# Altium project TDII_PCB.PrjPcb
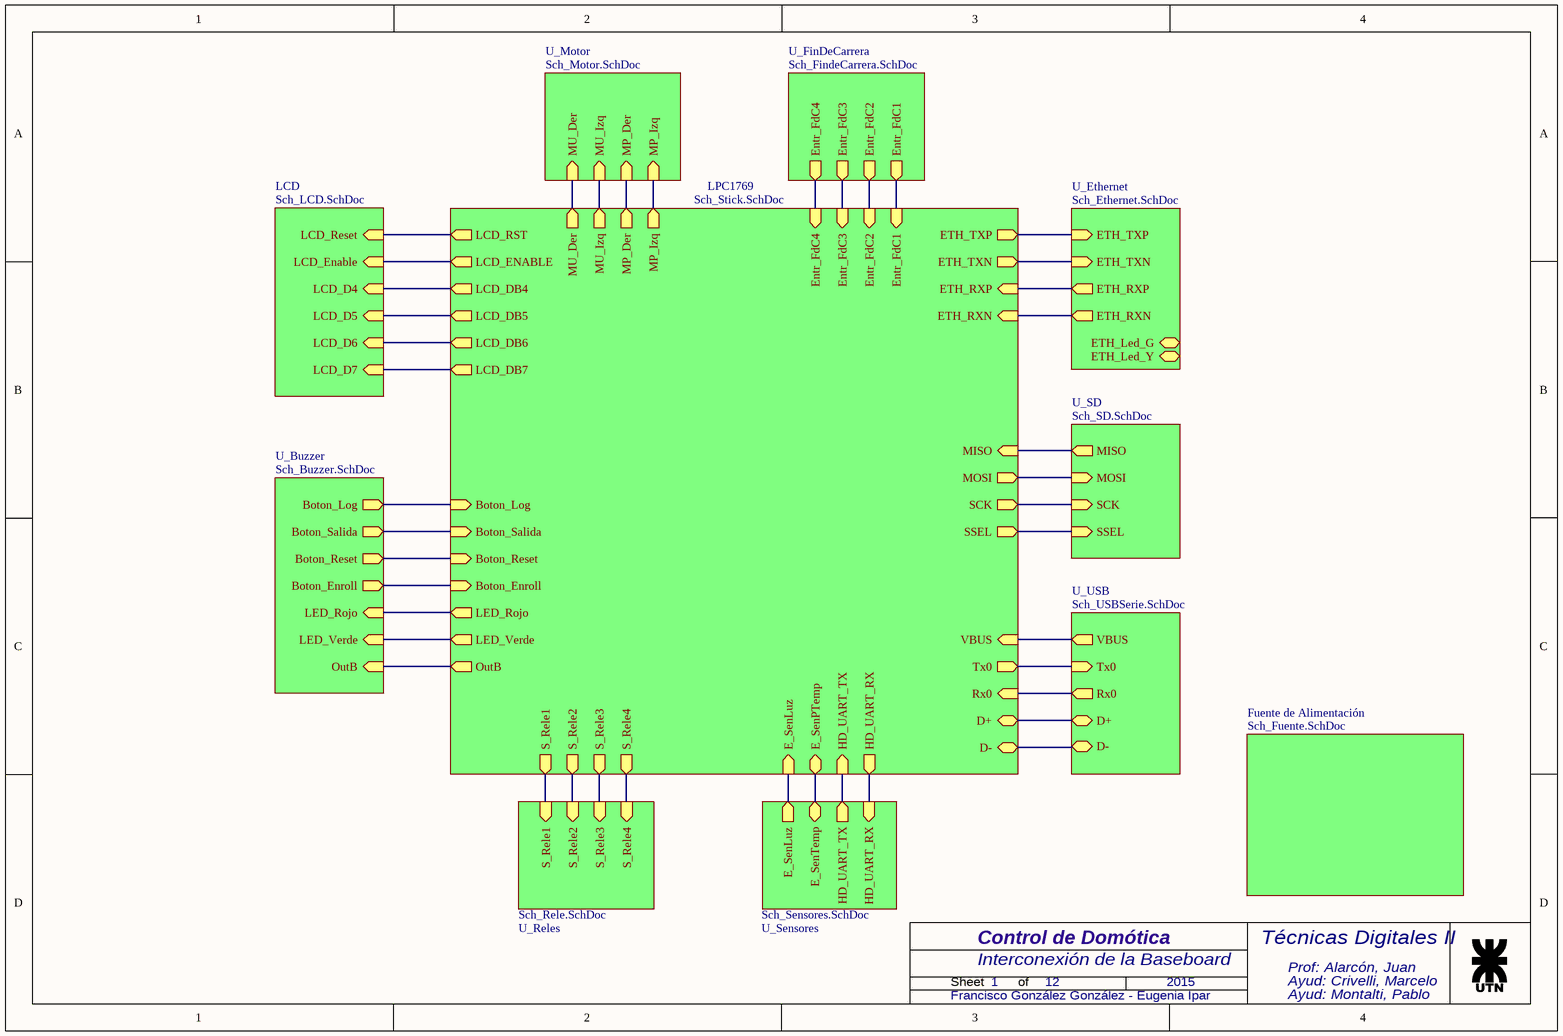
[diagram p0: Sch_BaseBoard.SchDoc]
12 sheets, 134 parts. Net scope: hierarchical (ports join the sheet entries above them; power ports are global).
Board files: PCB_Completo.PcbDoc, PCB_Negativo.PcbDoc
Sheets:
  Sch_BaseBoard.SchDoc
    LPC1769 = Sch_Stick.SchDoc
    U_Ethernet = Sch_Ethernet.SchDoc
    U_Buzzer = Sch_Buzzer.SchDoc
    U_FinDeCarrera = Sch_FindeCarrera.SchDoc
    U_Reles = Sch_Rele.SchDoc
    U_SD = Sch_SD.SchDoc
    U_Sensores = Sch_Sensores.SchDoc
    U_USB = Sch_USBSerie.SchDoc
    U_Motor = Sch_Motor.SchDoc
    LCD = Sch_LCD.SchDoc
    Fuente de Alimentación = Sch_Fuente.SchDoc

## Sheet Sch_BaseBoard.SchDoc: Control de Domótica
size A4; Author: Francisco González González - Eugenia Ipar; CompanyName: Interconexión de la Baseboard; Organization: Altium Limited; Address1: L3, 12a Rodborough Rd; Address2: Frenchs Forest; Address3: NSW; Address4: Australia 2086; DocumentNumber: 1; SheetNumber: 1; SheetTotal: 12; Materia: Técnicas Digitales II; Year: 2015; Placa: Base Board; Prof1: Prof: Alarcón, Juan; Prof2: Ayud: Crivelli, Marcelo; Prof3: Ayud: Montalti, Pablo

### Sub-sheets
Fuente de Alimentación = Sch_Fuente.SchDoc: no entries
LCD = Sch_LCD.SchDoc: LCD_Reset (in), LCD_Enable (in), LCD_D4 (in), LCD_D5 (in), LCD_D6 (in), LCD_D7 (in)
LPC1769 = Sch_Stick.SchDoc: Entr_FdC1 (in), Entr_FdC2 (in), Entr_FdC3 (in), OutB (out), E_SenPTemp (bidir), HD_UART_TX (in), MISO (in), MOSI (out), SCK (out), SSEL (out), Tx0 (out), Rx0 (in), ETH_TXP (out), ETH_TXN (out), ETH_RXP (in), ETH_RXN (in), MP_Izq (out), MP_Der (out), MU_Izq (out), MU_Der (out), D+ (bidir), Entr_FdC4 (in), LCD_RST (out), LCD_ENABLE (out), LCD_DB4 (out), LCD_DB5 (out), LCD_DB6 (out), LCD_DB7 (out), LED_Verde (out), LED_Rojo (out), Boton_Enroll (in), Boton_Reset (in), Boton_Salida (in), S_Rele1 (out), S_Rele2 (out), S_Rele3 (out), S_Rele4 (out), D- (bidir), HD_UART_RX (out), E_SenLuz (in), VBUS (in), Boton_Log (in)
U_Buzzer = Sch_Buzzer.SchDoc: OutB (in), LED_Rojo (in), Boton_Enroll (out), Boton_Reset (out), Boton_Salida (out), LED_Verde (in), Boton_Log (out)
U_Ethernet = Sch_Ethernet.SchDoc: ETH_TXP (in), ETH_TXN (in), ETH_RXP (out), ETH_RXN (out), ETH_Led_G, ETH_Led_Y
U_FinDeCarrera = Sch_FindeCarrera.SchDoc: Entr_FdC1 (out), Entr_FdC2 (out), Entr_FdC3 (out), Entr_FdC4 (out)
U_Motor = Sch_Motor.SchDoc: MP_Izq (in), MP_Der (in), MU_Izq (in), MU_Der (in)
U_Reles = Sch_Rele.SchDoc: S_Rele1 (in), S_Rele2 (in), S_Rele3 (in), S_Rele4 (in)
U_SD = Sch_SD.SchDoc: MISO (out), MOSI (in), SSEL (in), SCK (in)
U_Sensores = Sch_Sensores.SchDoc: E_SenLuz (out), E_SenTemp (bidir), HD_UART_TX (out), HD_UART_RX (in)
U_USB = Sch_USBSerie.SchDoc: Tx0 (in), Rx0 (out), D+ (bidir), D- (bidir), VBUS (out)

### Nets
Boton_Log: sheet LPC1769/Boton_Log, sheet U_Buzzer/Boton_Log
Botón_Enroll: sheet LPC1769/Boton_Enroll, sheet U_Buzzer/Boton_Enroll
Botón_Reset: sheet LPC1769/Boton_Reset, sheet U_Buzzer/Boton_Reset
Botón_Salida: sheet LPC1769/Boton_Salida, sheet U_Buzzer/Boton_Salida
ETH_RXN: sheet LPC1769/ETH_RXN, sheet U_Ethernet/ETH_RXN
ETH_RXP: sheet LPC1769/ETH_RXP, sheet U_Ethernet/ETH_RXP
ETH_TXN: sheet LPC1769/ETH_TXP, sheet U_Ethernet/ETH_TXP
ETH_TXP: sheet LPC1769/ETH_TXN, sheet U_Ethernet/ETH_TXN
FdC1: sheet LPC1769/Entr_FdC1, sheet U_FinDeCarrera/Entr_FdC1
FdC2: sheet LPC1769/Entr_FdC2, sheet U_FinDeCarrera/Entr_FdC2
FdC3: sheet LPC1769/Entr_FdC3, sheet U_FinDeCarrera/Entr_FdC3
FdC4: sheet LPC1769/Entr_FdC4, sheet U_FinDeCarrera/Entr_FdC4
LCD_DB4: sheet LPC1769/LCD_DB4, sheet LCD/LCD_D4
LCD_DB5: sheet LPC1769/LCD_DB5, sheet LCD/LCD_D5
LCD_DB6: sheet LPC1769/LCD_DB6, sheet LCD/LCD_D6
LCD_DB7: sheet LPC1769/LCD_DB7, sheet LCD/LCD_D7
LCD_ENABLE: sheet LPC1769/LCD_ENABLE, sheet LCD/LCD_Enable
LCD_RST: sheet LPC1769/LCD_RST, sheet LCD/LCD_Reset
LED_Rojo: sheet LPC1769/LED_Rojo, sheet U_Buzzer/LED_Rojo
LED_Verde: sheet LPC1769/LED_Verde, sheet U_Buzzer/LED_Verde
MISO: sheet LPC1769/MISO, sheet U_SD/MISO
MOSI: sheet LPC1769/MOSI, sheet U_SD/MOSI
OBuzzer: sheet LPC1769/OutB, sheet U_Buzzer/OutB
Persi_Der: sheet LPC1769/MP_Der, sheet U_Motor/MP_Der
Persi_Izq: sheet LPC1769/MP_Izq, sheet U_Motor/MP_Izq
Puerta_Der: sheet LPC1769/MU_Der, sheet U_Motor/MU_Der
Puerta_Izq: sheet LPC1769/MU_Izq, sheet U_Motor/MU_Izq
Rele1: sheet LPC1769/S_Rele3, sheet U_Reles/S_Rele3
Rele2: sheet LPC1769/S_Rele4, sheet U_Reles/S_Rele4
Rele3: sheet LPC1769/S_Rele2, sheet U_Reles/S_Rele2
Rele4: sheet LPC1769/S_Rele1, sheet U_Reles/S_Rele1
Rx0: sheet LPC1769/Rx0, sheet U_USB/Rx0
RXD2: sheet LPC1769/Tx0, sheet U_USB/Tx0
RXD3: sheet LPC1769/HD_UART_TX, sheet U_Sensores/HD_UART_TX
SCK: sheet LPC1769/SCK, sheet U_SD/SCK
SenLuz: sheet LPC1769/E_SenLuz, sheet U_Sensores/E_SenLuz
Sensor_Temp: sheet LPC1769/E_SenPTemp, sheet U_Sensores/E_SenTemp
SSEL: sheet LPC1769/SSEL, sheet U_SD/SSEL
TXD3: sheet LPC1769/HD_UART_RX, sheet U_Sensores/HD_UART_RX
USB_D+: sheet LPC1769/D+, sheet U_USB/D+
USB_D-: sheet LPC1769/D-, sheet U_USB/D-
VBUS: sheet LPC1769/VBUS, sheet U_USB/VBUS

### Notes on the sheet
- Sheet
- of

## Sheet Sch_Stick.SchDoc: Control de Domótica
size A4; Author: Francisco González González - Eugenia Ipar; CompanyName: Conexión del LPC1769; Organization: Altium Limited; Address1: L3, 12a Rodborough Rd; Address2: Frenchs Forest; Address3: NSW; Address4: Australia 2086; DocumentNumber: 2; SheetNumber: 2; SheetTotal: 12; Materia: Técnicas Digitales II; Year: 2015; Placa: Conexión a LPCXpresso 1769; Prof1: Prof: Alarcón, Juan; Prof2: Ayud: Crivelli, Marcelo; Prof3: Ayud: Montalti, Pablo
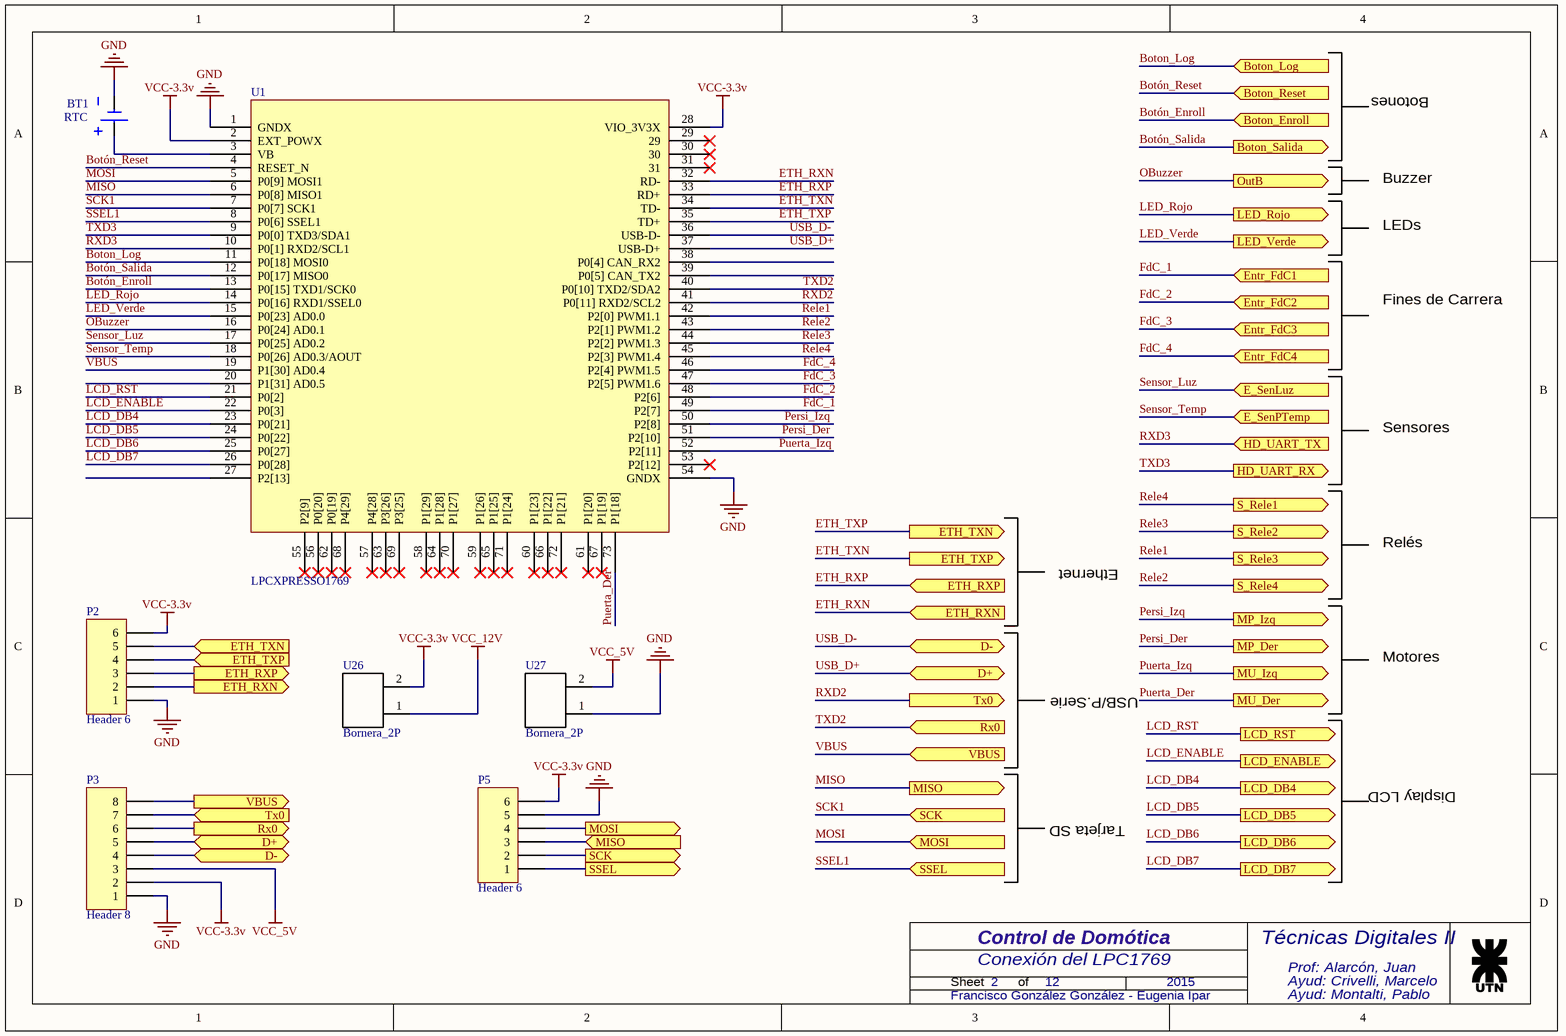
[diagram p1: Sch_Stick.SchDoc]

### Parts
BT1  Comment_1: RTC  [TECO-120591-1-2_V]  (hidden comment: 120591-1)
P2  Header 6  [HDR1X6]
P3  Header 8  [HDR1X8]
P5  Header 6  [HDR1X6]
U1  LPCXPRESSO1769  [Stick]
U26  Bornera_2P  [Bornera]
U27  Bornera_2P  [Bornera]

### Ports
Boton_Enroll (in), Boton_Log (in), Boton_Reset (in), Boton_Salida (out), D+ (bidir), D- (bidir), E_SenLuz (in), E_SenPTemp (in), Entr_FdC1 (in), Entr_FdC2 (in), Entr_FdC3 (in), Entr_FdC4 (in), ETH_RXN (in), ETH_RXN (out), ETH_RXP (in), ETH_RXP (out), ETH_TXN (in), ETH_TXN (out), ETH_TXP (in), ETH_TXP (out), HD_UART_RX (out), HD_UART_TX (in), LCD_DB4 (out), LCD_DB5 (out), LCD_DB6 (out), LCD_DB7 (out), LCD_ENABLE (out), LCD_RST (out), LED_Rojo (out), LED_Verde (out), MISO (in), MISO (out), MOSI (in), MOSI (out), MP_Der (out), MP_Izq (out), MU_Der (out), MU_Izq (out), OutB (out), Rx0 (in), Rx0 (out), S_Rele1 (out), S_Rele2 (out), S_Rele3 (out), S_Rele4 (out), SCK (in), SCK (out), SSEL (in), SSEL (out), Tx0 (in), Tx0 (out), VBUS (in), VBUS (out)

### Nets
GND: BT1.2(-) P2.1 P3.1 P5.5 U1.1(GNDX) U1.54(GNDX) U27.1
VCC-3.3v: P2.6 P3.2 P5.6 U1.2(EXT_POWX) U1.28(VIO_3V3X) U26.2
VCC_5V: P3.3 U27.2
VCC_12V: U26.1
Boton_Log: U1.11(P0[18]_MOSI0) ; port Boton_Log
Botón_Enroll: U1.13(P0[15]_TXD1/SCK0) ; port Boton_Enroll
Botón_Reset: U1.4(RESET_N) ; port Boton_Reset
Botón_Salida: U1.12(P0[17]_MISO0) ; port Boton_Salida
ETH_RXN: P2.2 U1.32(RD-) ; port ETH_RXN
ETH_RXP: P2.3 U1.33(RD+) ; port ETH_RXP
ETH_TXN: P2.4 U1.34(TD-) ; port ETH_TXP
ETH_TXP: P2.5 U1.35(TD+) ; port ETH_TXN
FdC_1: U1.49(P2[7]) ; port Entr_FdC1  [project net FdC1]
FdC_2: U1.48(P2[6]) ; port Entr_FdC2  [project net FdC2]
FdC_3: U1.47(P2[5]_PWM1.6) ; port Entr_FdC3  [project net FdC3]
FdC_4: U1.46(P2[4]_PWM1.5) ; port Entr_FdC4  [project net FdC4]
LCD_DB4: U1.23(P0[21]) ; port LCD_DB4
LCD_DB5: U1.24(P0[22]) ; port LCD_DB5
LCD_DB6: U1.25(P0[27]) ; port LCD_DB6
LCD_DB7: U1.26(P0[28]) ; port LCD_DB7
LCD_ENABLE: U1.22(P0[3]) ; port LCD_ENABLE
LCD_RST: U1.21(P0[2]) ; port LCD_RST
LED_Rojo: U1.14(P0[16]_RXD1/SSEL0) ; port LED_Rojo
LED_Verde: U1.15(P0[23]_AD0.0) ; port LED_Verde
MISO: P5.3 U1.6(P0[8]_MISO1) ; port MISO
MOSI: P5.4 U1.5(P0[9]_MOSI1) ; port MOSI
OBuzzer: U1.16(P0[24]_AD0.1) ; port OutB
Persi_Der: U1.51(P2[10]) ; port MP_Der
Persi_Izq: U1.50(P2[8]) ; port MP_Izq
Puerta_Der: U1.73(P1[18]) ; port MU_Der
Puerta_Izq: U1.52(P2[11]) ; port MU_Izq
Rele1: U1.42(P2[0]_PWM1.1) ; port S_Rele3
Rele2: U1.43(P2[1]_PWM1.2) ; port S_Rele4
Rele3: U1.44(P2[2]_PWM1.3) ; port S_Rele2
Rele4: U1.45(P2[3]_PWM1.4) ; port S_Rele1
RXD2: P3.7 U1.41(P0[11]_RXD2/SCL2) ; port Tx0
RXD3: U1.10(P0[1]_RXD2/SCL1) ; port HD_UART_TX
SCK1: P5.2 U1.7(P0[7]_SCK1) ; port SCK  [project net SCK]
Sensor_Luz: U1.17(P0[25]_AD0.2) ; port E_SenLuz  [project net SenLuz]
Sensor_Temp: U1.18(P0[26]_AD0.3/AOUT) ; port E_SenPTemp
SSEL1: P5.1 U1.8(P0[6]_SSEL1) ; port SSEL  [project net SSEL]
TXD2: P3.6 U1.40(P0[10]_TXD2/SDA2) ; port Rx0  [project net Rx0]
TXD3: U1.9(P0[0]_TXD3/SDA1) ; port HD_UART_RX
USB_D+: P3.5 U1.37(USB-D+) ; port D+
USB_D-: P3.4 U1.36(USB-D-) ; port D-
VBUS: P3.8 U1.19(P1[30]_AD0.4) ; port VBUS
NetBT1_1: BT1.1(+) U1.3(VB)

Not connected (* = marked no-connect by the designer): U1 20(P1[31]_AD0.5) 27(P2[13]) 29* 30* 31* 38(P0[4]_CAN_RX2) 39(P0[5]_CAN_TX2) 53(P2[12])* 55(P2[9])* 56(P0[20])* 57(P4[28])* 58(P1[29])* 59(P1[26])* 60(P1[23])* 61(P1[20])* 62(P0[19])* 63(P3[26])* 64(P1[28])* 65(P1[25])* 66(P1[22])* 67(P1[19])* 68(P4[29])* 69(P3[25])* 70(P1[27])* 71(P1[24])* 72(P1[21])*

### Notes on the sheet
- Botones
- Buzzer
- LEDs
- Fines de Carrera
- Sensores
- Ethernet
- Relés
- USB/P.Serie
- Motores
- Display LCD
- Tarjeta SD
- Sheet
- of

### Library data of the parts
BT1 = CMP-0438-00001-1: Lithium Battery Holder for CR2032 3V Cell; Manufacturer: TE Connectivity; Body Shape: Horizontal Cylindrical; Packing Type: Tray; ComponentLink2Description: Datasheet; ComponentLink2URL: http://www.te.com/commerce/DocumentDelivery/DDEController?Action=showdoc&DocId=Customer+Drawing%7F120591%7FH%7Fpdf%7FEnglish%7FENG_CD_120591_H.pdf%7F120591-1; DatasheetVersion: Rev. H, 01/2013; PackageReference: 120591-1; ComponentLink1Description: Manufacturer URL; Mounting Technology: Through Hole; PackageDescription: Lithium Battery Holder; ComponentLink1URL: http://www.te.com/; PartNumber: 120591-1
P2 P5 = Header 6: Header, 6-Pin; LatestRevisionDate: 17-Jul-2002; LatestRevisionNote: Re-released for DXP Platform.; Publisher: Altium Limited
P3 = Header 8: Header, 8-Pin; LatestRevisionDate: 17-Jul-2002; LatestRevisionNote: Re-released for DXP Platform.; Publisher: Altium Limited
U1 = LPC1769_Stick

## Sheet Sch_Ethernet.SchDoc: Control de Domótica
size A4; Author: Francisco González González - Eugenia Ipar; CompanyName: Conexión a placa Ethernet; DocumentNumber: 12; SheetNumber: 12; SheetTotal: 12; Materia: Técnicas Digitales II; Placa: Conexión Ethernet; Year: 2015; Prof1: Prof: Alarcón, Juan; Prof2: Ayud: Crivelli, Marcelo; Prof3: Ayud: Montalti, Pablo; PageSetup: Record=PageOptions|CenterHorizontal=True|CenterVertical=True|PrintScale=1.00|XCorrection=1.00|YCorrection=1.00|PrintKind=0|BorderSize=5000000|LeftOffset=0|BottomOffset=0|Orientation=2|PaperLength=1000|PaperWidth=1000|Scale=100|PaperSource=7|PrintQuality=-3|MediaType=1|DitherType=10|PrintScaleMode=1|PaperKind=A4|PaperIndex=9
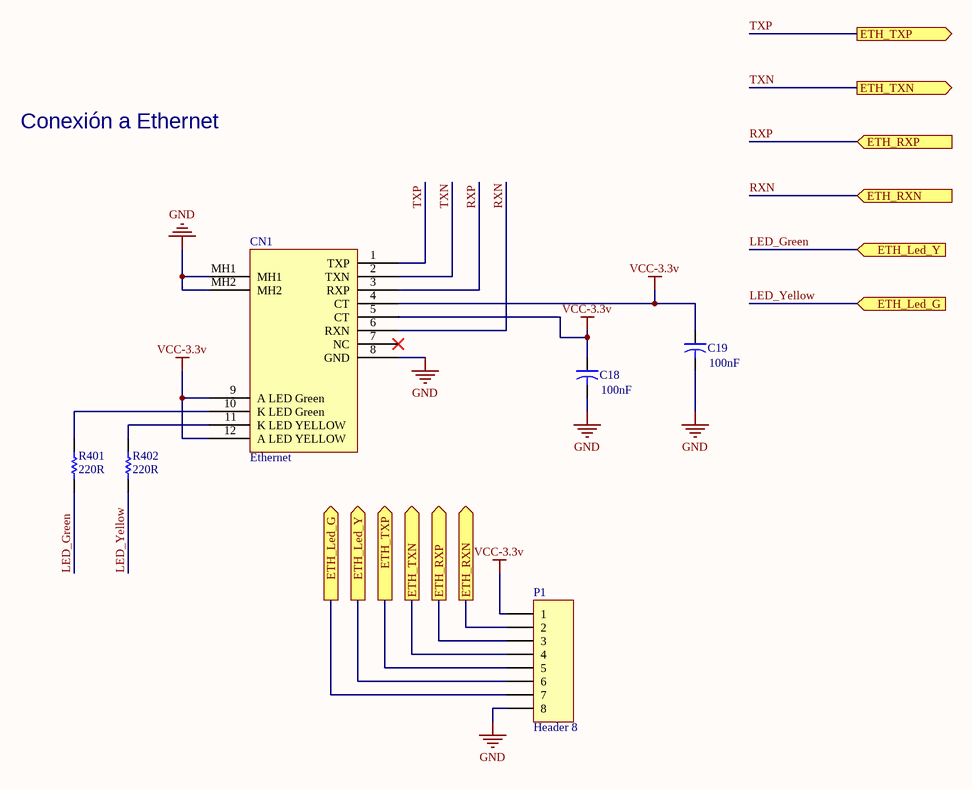
[diagram p2: Sch_Ethernet.SchDoc]

### Parts
C18  value 100nF  [CAPR5-4X5]  (hidden comment: Cap2)
C19  value 100nF  [CAPR5-4X5]  (hidden comment: Cap2)
CN1  Ethernet  [RJ45]
P1  Header 8  [HDR1X8]
R401  value 220R  [AXIAL-0.3]  (hidden comment: Res1)
R402  value 220R  [AXIAL-0.3]  (hidden comment: Res1)

### Ports
ETH_Led_G (in), ETH_Led_G (out), ETH_Led_Y (in), ETH_Led_Y (out), ETH_RXN (in), ETH_RXN (out), ETH_RXP (in), ETH_RXP (out), ETH_TXN (out), ETH_TXP (out)

### Nets
GND: C18.2 C19.2 CN1.8(GND) CN1.MH1 CN1.MH2 P1.8
VCC-3.3v: C18.1 C19.1 CN1.4(CT) CN1.5(CT) CN1.9(A_LED_Green) CN1.12(A_LED_YELLOW) P1.1
LED_Green: P1.6 R401.1 ; port ETH_Led_Y
LED_Yellow: P1.7 R402.1 ; port ETH_Led_G
RXN: CN1.6(RXN) P1.2 ; port ETH_RXN  [project net ETH_RXN]
RXP: CN1.3(RXP) P1.3 ; port ETH_RXP  [project net ETH_RXP]
TXN: CN1.2(TXN) P1.4 ; port ETH_TXN  [project net ETH_TXP]
TXP: CN1.1(TXP) P1.5 ; port ETH_TXP  [project net ETH_TXN]
NetCN1_10: CN1.10(K_LED_Green) R401.2
NetCN1_11: CN1.11(K_LED_YELLOW) R402.2

Not connected (* = marked no-connect by the designer): CN1 7(NC)*

### Notes on the sheet
- Conexión a Ethernet
- Sheet
- of

### Library data of the parts
C18 C19 = Cap2: Capacitor; Published: 23-Sep-2002; PackageReference: CAPR5-4X5; Publisher: Altium Limited; PackageDescription: Capacitor; 2 Leads
CN1 = Ethernet: RJ45 8pin Socket
P1 = Header 8: Header, 8-Pin; LatestRevisionDate: 17-Jul-2002; LatestRevisionNote: Re-released for DXP Platform.; Publisher: Altium Limited
R401 R402 = Res1: Resistor; Published: 8-Jun-2000; LatestRevisionDate: 17-Jul-2002; LatestRevisionNote: Re-released for DXP Platform.; PackageReference: AXIAL-0.3; Publisher: Altium Limited; PackageDescription: Axial Device, Thru-Hole; 2 Leads; 0.3 in Pin Spacing

## Sheet Sch_Buzzer.SchDoc: Control de Domótica
size A4; Author: Francisco González González - Eugenia Ipar; CompanyName: Botones, LEDs y Buzzer; Organization: Altium Limited; Address1: L3, 12a Rodborough Rd; Address2: Frenchs Forest; Address3: NSW; Address4: Australia 2086; DocumentNumber: 4; SheetNumber: 4; SheetTotal: 12; Materia: Técnicas Digitales II; Placa: Buzzer y Botones; Year: 2015; Prof1: Prof: Alarcón, Juan; Prof2: Ayud: Crivelli, Marcelo; Prof3: Ayud: Montalti, Pablo; PageSetup: Record=PageOptions|CenterHorizontal=True|CenterVertical=True|PrintScale=1.00|XCorrection=1.00|YCorrection=1.00|PrintKind=0|BorderSize=5000000|LeftOffset=0|BottomOffset=0|Orientation=2|PaperLength=1000|PaperWidth=1000|Scale=100|PaperSource=7|PrintQuality=-3|MediaType=1|DitherType=10|PrintScaleMode=1|PaperKind=A4|PaperIndex=9
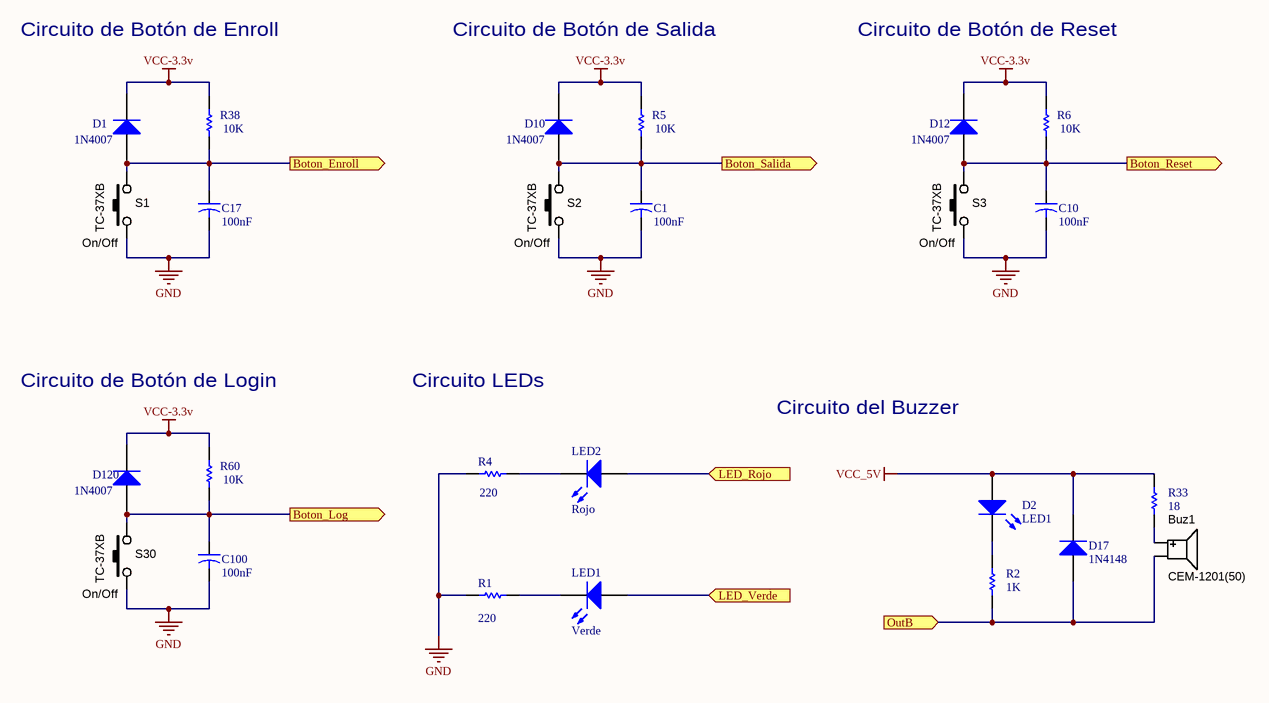
[diagram p3: Sch_Buzzer.SchDoc]

### Parts
Buz1  Manufacturer Part Number 1: CEM-1201(50)  [BUZZER_12.0X8.5MM]  (hidden comment: Alternate part: 3100-932)
C1  value 100nF  [CAPR5-4X5]  (hidden comment: Cap2)
C10  value 100nF  [CAPR5-4X5]  (hidden comment: Cap2)
C17  value 100nF  [CAPR5-4X5]  (hidden comment: Cap2)
C100  value 100nF  [CAPR5-4X5]  (hidden comment: Cap2)
D1  1N4007  [DO-41]
D2  LED1  [Type 3mm]
D10  1N4007  [DO-41]
D12  1N4007  [DO-41]
D17  1N4148  [DO-35]
D120  1N4007  [DO-41]
LED1  Verde  [Type 5mm]
LED2  Rojo  [Type 5mm]
R1  value 220  [AXIAL-0.3]  (hidden comment: Res1)
R2  value 1K  [AXIAL-0.3]  (hidden comment: Res1)
R4  value 220  [AXIAL-0.3]  (hidden comment: Res1)
R5  value 10K  [AXIAL-0.3]  (hidden comment: Res1)
R6  value 10K  [AXIAL-0.3]  (hidden comment: Res1)
R33  value 18  [AXIAL-0.3]  (hidden comment: Res1)
R38  value 10K  [AXIAL-0.3]  (hidden comment: Res1)
R60  value 10K  [AXIAL-0.3]  (hidden comment: Res1)
S1  Manufacturer Part Number 1: TC-37XB  Function: On/Off  [TACT-SWITCH-TC-37XB]  (hidden comment: SW_THT_PB_5.0mm)
S2  Manufacturer Part Number 1: TC-37XB  Function: On/Off  [TACT-SWITCH-TC-37XB]  (hidden comment: SW_THT_PB_5.0mm)
S3  Manufacturer Part Number 1: TC-37XB  Function: On/Off  [TACT-SWITCH-TC-37XB]  (hidden comment: SW_THT_PB_5.0mm)
S30  Manufacturer Part Number 1: TC-37XB  Function: On/Off  [TACT-SWITCH-TC-37XB]  (hidden comment: SW_THT_PB_5.0mm)

### Ports
Boton_Enroll (out), Boton_Log (out), Boton_Reset (out), Boton_Salida (out), LED_Rojo (in), LED_Verde (in), OutB (in)

### Nets
GND: C1.2 C10.2 C17.2 C100.2 R1.1 R4.1 S1.1 S2.1 S3.1 S30.1
VCC-3.3v: D1.2(K) D10.2(K) D12.2(K) D120.2(K) R5.2 R6.2 R38.2 R60.2
VCC_5V: D2.2(A) D17.2(K) R33.2
Boton_Log: C100.1 D120.1(A) R60.1 S30.2 ; port Boton_Log
Botón_Enroll: C17.1 D1.1(A) R38.1 S1.2 ; port Boton_Enroll
Botón_Reset: C10.1 D12.1(A) R6.1 S3.2 ; port Boton_Reset
Botón_Salida: C1.1 D10.1(A) R5.1 S2.2 ; port Boton_Salida
LED_Rojo: LED2.2(A) ; port LED_Rojo
LED_Verde: LED1.2(A) ; port LED_Verde
OBuzzer: Buz1.2(Negative) D17.1(A) R2.1 ; port OutB
NetBuz1_1: Buz1.1(Positive) R33.1
NetD2_1: D2.1(K) R2.2
NetLED1_1: LED1.1(K) R1.2
NetLED2_1: LED2.1(K) R4.2

### Notes on the sheet
- Circuito de Botón de Enroll
- Circuito de Botón de Salida
- Circuito de Botón de Reset
- Circuito de Botón de Login
- Circuito LEDs
- Circuito del Buzzer
- Sheet
- of

### Library data of the parts
Buz1 = BZ_12x8.5x6.5_2kHz: Speaker, Magnetic Transducer; Manufacturer 1: CUI Inc; Ratings: 2048 ±200 Hz; SCDType: source; Package / Case: 6.5mm pitch; Material: Noryl SE1-J; Supplier 1: Digi-Key; Supplier Part Number 1: 102-1152-ND
C1 C10 C17 C100 = Cap2: Capacitor; Published: 23-Sep-2002; PackageReference: CAPR5-4X5; Publisher: Altium Limited; PackageDescription: Capacitor; 2 Leads
D1 D10 D12 D120 = Diode 1N4007: 1 Amp General Purpose Rectifier; Published: 8-Jun-2000; LatestRevisionDate: 17-Jul-2002; LatestRevisionNote: Re-released for DXP Platform.; DatasheetVersion: 1998; PackageVersion: Aug-1999; PackageReference: DO-41; Publisher: Altium Limited; PackageDescription: Diode, Axial; Body 5.2 x 2.7 mm (LxDia. max), Lead Dia. 0.86 mm (max); Code_JEDEC: DO-204-AL; ComponentLink1Description: Manufacturer Link; ComponentLink1URL: http://www.fairchildsemi.com/; ComponentLink2Description: Datasheet; ComponentLink2URL: http://www.fairchildsemi.com/ds/1N%2F1N4001.pdf
D2 = CMP-1488-00002-1: THT LED round mono-color color lens, WL-TMRW, Super Red; PartNumber: 151031SS06000; Manufacturer: Wuerth Elektronik; ComponentLink2URL: http://katalog.we-online.de/pbs/datasheet/7448042001.pdfhttp://katalog.we-online.de/pbs/datasheet/7448042001.pdfhttp://katalog.we-online.de/pbs/datasheet/7448042001.pdfhttp://katalog.we-online.de/pbs/datasheet/151031SS06000.pdf; ComponentLink1URL: http://www.we-online.com; ComponentLink2Description: Datasheet; PackageReference: Type 3mm; Emitting color: Super Red; ComponentLink1Description: Manufacturer URL
D17 = Diode 1N4148: High Conductance Fast Diode; Published: 8-Jun-2000; LatestRevisionDate: 17-Jul-2002; LatestRevisionNote: Re-released for DXP Platform.; DatasheetVersion: 1997; PackageReference: DO-35; Publisher: Altium Limited; PackageDescription: Diode, Axial; Body 3.8 x 1.9 mm (LxDia. max), Lead Dia. 0.53 mm (max); Code_JEDEC: DO-204-AH; ComponentLink1Description: Manufacturer Link; ComponentLink1URL: http://www.fairchildsemi.com/; ComponentLink2Description: Datasheet; ComponentLink2URL: http://www.fairchildsemi.com/ds/1N%2F1N4148.pdf
LED1 = CMP-1489-00005-1: THT LED round mono-color waterclear, WL-TMRW, Green; PartNumber: 151053GS03000; Manufacturer: Wuerth Elektronik; ComponentLink2URL: http://katalog.we-online.de/pbs/datasheet/7448042001.pdfhttp://katalog.we-online.de/pbs/datasheet/7448042001.pdfhttp://katalog.we-online.de/pbs/datasheet/7448042001.pdfhttp://katalog.we-online.de/pbs/datasheet/151053GS03000.pdf; ComponentLink2Description: Datasheet; ComponentLink1URL: http://www.we-online.com; PackageReference: Type 5mm; ComponentLink1Description: Manufacturer URL; Emitting color: Green
LED2 = CMP-1488-00008-1: THT LED round mono-color color lens, WL-TMRW, Red; PartNumber: 151051RS11000; Manufacturer: Wuerth Elektronik; PackageReference: Type 5mm; ComponentLink2URL: http://katalog.we-online.de/pbs/datasheet/7448042001.pdfhttp://katalog.we-online.de/pbs/datasheet/7448042001.pdfhttp://katalog.we-online.de/pbs/datasheet/7448042001.pdfhttp://katalog.we-online.de/pbs/datasheet/151051RS11000.pdf; ComponentLink1URL: http://www.we-online.com; ComponentLink1Description: Manufacturer URL; ComponentLink2Description: Datasheet; Emitting color: Red
R1 R2 R4-R6 R33 R38 R60 = Res1: Resistor; Published: 8-Jun-2000; LatestRevisionDate: 17-Jul-2002; LatestRevisionNote: Re-released for DXP Platform.; PackageReference: AXIAL-0.3; Publisher: Altium Limited; PackageDescription: Axial Device, Thru-Hole; 2 Leads; 0.3 in Pin Spacing
S1-S3 S30 = SW_THT_PB_5.0mm: Switch, tact, 5.0mm stem; Manufacturer 1: Wealth Metal; SCDType: spec; Package / Case: 6.5x6.5mm; 5.0mm stem; Material: Brass/Nylon/Ag plating

## Sheet Sch_FindeCarrera.SchDoc: Control de Domótica
size A4; Author: Francisco González González - Eugenia Ipar; CompanyName: Control de los Fines de Carrera; DocumentNumber: 6; SheetNumber: 6; SheetTotal: 12; Materia: Técnicas Digitales II; Year: 2015; Placa: Sensores Fines de Carrera; Prof1: Prof: Alarcón, Juan; Prof2: Ayud: Crivelli, Montalti; Prof3: Ayud: Montalti, Pablo; PageSetup: Record=PageOptions|CenterHorizontal=True|CenterVertical=True|PrintScale=1.00|XCorrection=1.00|YCorrection=1.00|PrintKind=0|BorderSize=5000000|LeftOffset=0|BottomOffset=0|Orientation=2|PaperLength=1000|PaperWidth=1000|Scale=100|PaperSource=7|PrintQuality=-3|MediaType=1|DitherType=10|PrintScaleMode=1|PaperKind=A4|PaperIndex=9
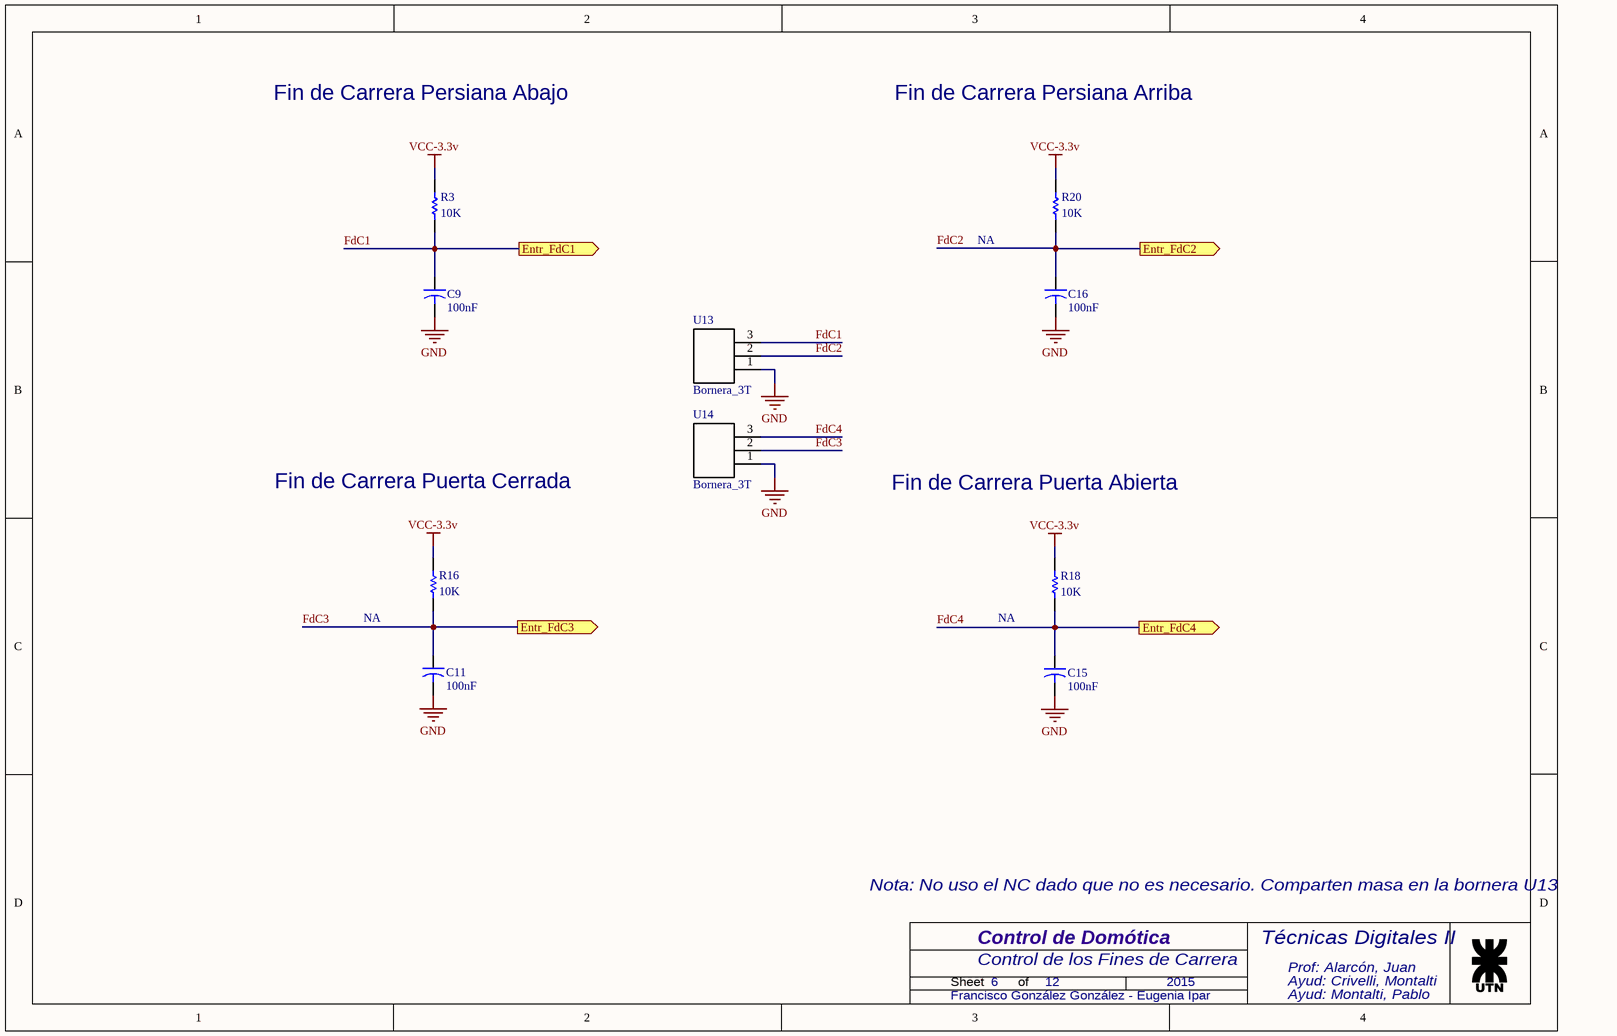
[diagram p4: Sch_FindeCarrera.SchDoc]

### Parts
C9  value 100nF  [CAPR5-4X5]  (hidden comment: Cap2)
C11  value 100nF  [CAPR5-4X5]  (hidden comment: Cap2)
C15  value 100nF  [CAPR5-4X5]  (hidden comment: Cap2)
C16  value 100nF  [CAPR5-4X5]  (hidden comment: Cap2)
R3  value 10K  [AXIAL-0.3]  (hidden comment: Res1)
R16  value 10K  [AXIAL-0.3]  (hidden comment: Res1)
R18  value 10K  [AXIAL-0.3]  (hidden comment: Res1)
R20  value 10K  [AXIAL-0.3]  (hidden comment: Res1)
U13  Bornera_3T  [BORNERA_3]
U14  Bornera_3T  [BORNERA_3]

### Ports
Entr_FdC1 (out), Entr_FdC2 (out), Entr_FdC3 (out), Entr_FdC4 (out)

### Nets
GND: C9.2 C11.2 C15.2 C16.2 U13.1 U14.1
VCC-3.3v: R3.2 R16.2 R18.2 R20.2
FdC1: C9.1 R3.1 U13.3 ; port Entr_FdC1
FdC2: C16.1 R20.1 U13.2 ; port Entr_FdC2
FdC3: C11.1 R16.1 U14.2 ; port Entr_FdC3
FdC4: C15.1 R18.1 U14.3 ; port Entr_FdC4

### Notes on the sheet
- Fin de Carrera Persiana Abajo
- Fin de Carrera Persiana Arriba
- NA
- Fin de Carrera Puerta Cerrada
- Fin de Carrera Puerta Abierta
- Nota: No uso el NC dado que no es necesario. Comparten masa en la bornera U13
- Sheet
- of

### Library data of the parts
C9 C11 C15 C16 = Cap2: Capacitor; Published: 23-Sep-2002; PackageReference: CAPR5-4X5; Publisher: Altium Limited; PackageDescription: Capacitor; 2 Leads
R3 R16 R18 R20 = Res1: Resistor; Published: 8-Jun-2000; LatestRevisionDate: 17-Jul-2002; LatestRevisionNote: Re-released for DXP Platform.; PackageReference: AXIAL-0.3; Publisher: Altium Limited; PackageDescription: Axial Device, Thru-Hole; 2 Leads; 0.3 in Pin Spacing
U13 U14 = Bornera_3T: Bornera de 3 Terminales Pitch 5mm

## Sheet Sch_Rele.SchDoc: Control de Domótica
size A4; Author: Francisco González González - Eugenia Ipar; CompanyName: Circuito de Relés; DocumentNumber: 7; SheetNumber: 7; SheetTotal: 12; Materia: Técnicas Digitales II; Placa: Conexión a Relés - 12V; Year: 2015; Prof1: Prof: Alarcón, Juan; Prof2: Ayud: Crivelli, Marcelo; Prof3: Ayud: Montalti, Pablo; PageSetup: Record=PageOptions|CenterHorizontal=True|CenterVertical=True|PrintScale=1.00|XCorrection=1.00|YCorrection=1.00|PrintKind=0|BorderSize=5000000|LeftOffset=0|BottomOffset=0|Orientation=2|PaperLength=1000|PaperWidth=1000|Scale=100|PaperSource=7|PrintQuality=-3|MediaType=1|DitherType=10|PrintScaleMode=1|PaperKind=A4|PaperIndex=9
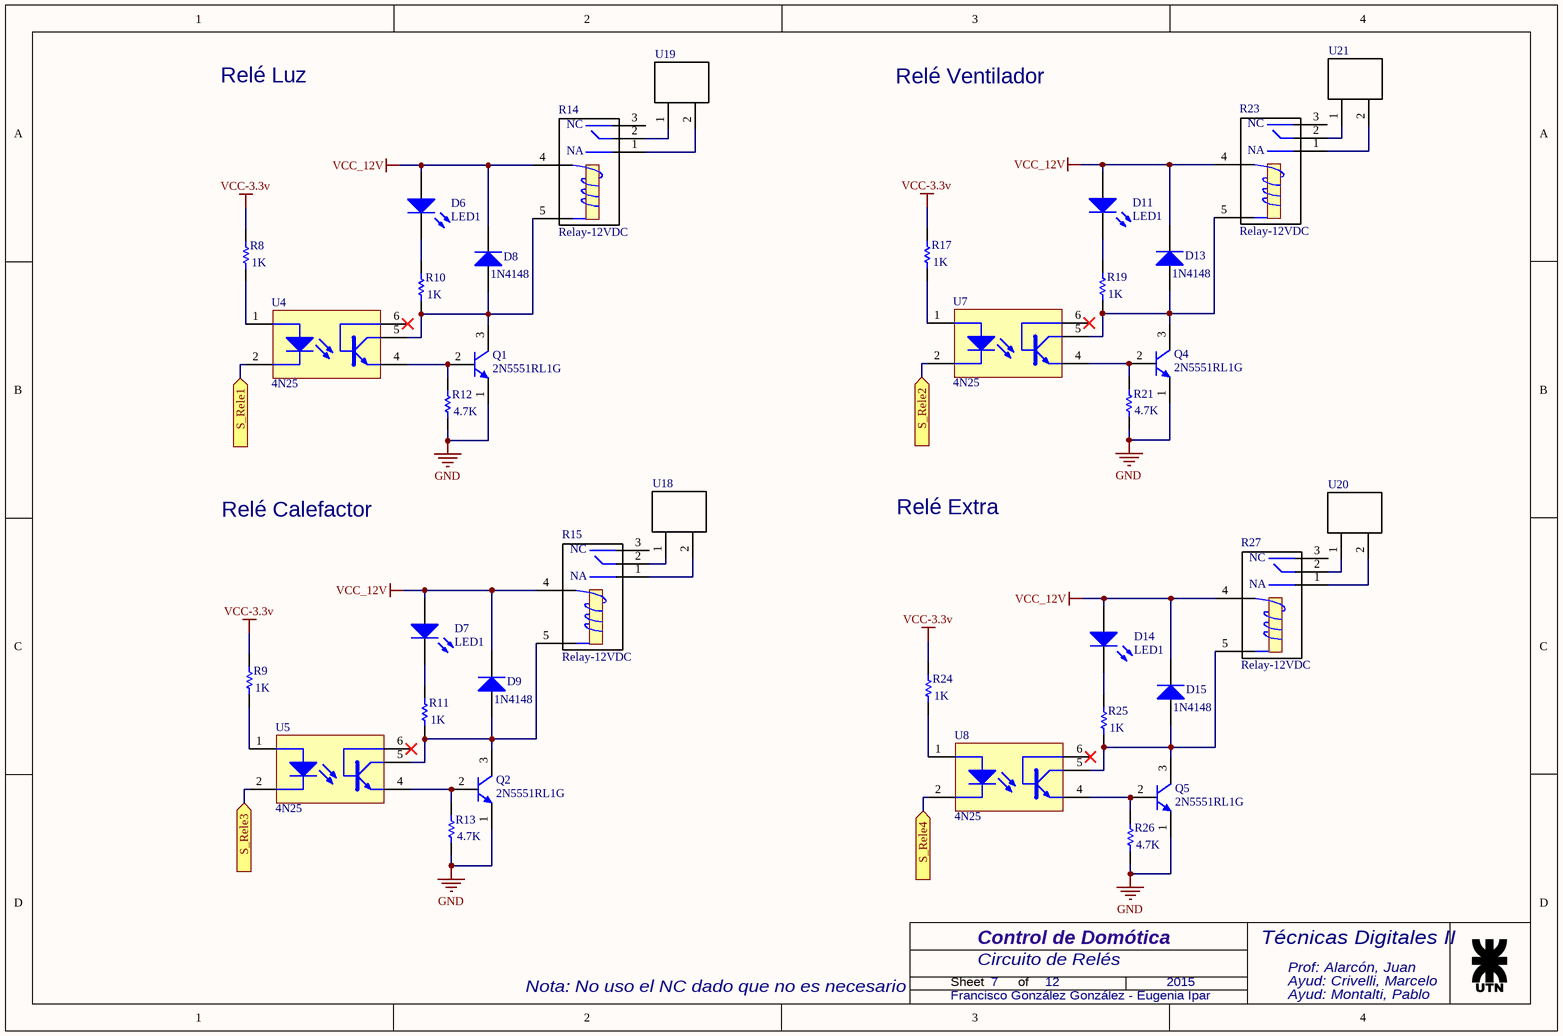
[diagram p5: Sch_Rele.SchDoc]

### Parts
D6  LED1  [Type 3mm]
D7  LED1  [Type 3mm]
D8  1N4148  [DO-35]
D9  1N4148  [DO-35]
D11  LED1  [Type 3mm]
D13  1N4148  [DO-35]
D14  LED1  [Type 3mm]
D15  1N4148  [DO-35]
Q1  2N5551RL1G  [ONSC-TO-92-3-29-11_AM_BL]
Q2  2N5551RL1G  [ONSC-TO-92-3-29-11_AM_BL]
Q4  2N5551RL1G  [ONSC-TO-92-3-29-11_AM_BL]
Q5  2N5551RL1G  [ONSC-TO-92-3-29-11_AM_BL]
R8  value 1K  [AXIAL-0.3]  (hidden comment: Res1)
R9  value 1K  [AXIAL-0.3]  (hidden comment: Res1)
R10  value 1K  [AXIAL-0.3]  (hidden comment: Res1)
R11  value 1K  [AXIAL-0.3]  (hidden comment: Res1)
R12  value 4.7K  [AXIAL-0.3]  (hidden comment: Res1)
R13  value 4.7K  [AXIAL-0.3]  (hidden comment: Res1)
R14  Relay-12VDC  [Rele]
R15  Relay-12VDC  [Rele]
R17  value 1K  [AXIAL-0.3]  (hidden comment: Res1)
R19  value 1K  [AXIAL-0.3]  (hidden comment: Res1)
R21  value 4.7K  [AXIAL-0.3]  (hidden comment: Res1)
R23  Relay-12VDC  [Rele]
R24  value 1K  [AXIAL-0.3]  (hidden comment: Res1)
R25  value 1K  [AXIAL-0.3]  (hidden comment: Res1)
R26  value 4.7K  [AXIAL-0.3]  (hidden comment: Res1)
R27  Relay-12VDC  [Rele]
U4  4N25  [DIP6]
U5  4N25  [DIP6]
U7  4N25  [DIP6]
U8  4N25  [DIP6]
U18  Bornera_2P  [Bornera]  (value not drawn)
U19  Bornera_2P  [Bornera]  (value not drawn)
U20  Bornera_2P  [Bornera]  (value not drawn)
U21  Bornera_2P  [Bornera]  (value not drawn)

### Ports
S_Rele1 (in), S_Rele2 (in), S_Rele3 (in), S_Rele4 (in)

### Nets
GND: Q1.1(E) Q2.1(E) Q4.1(E) Q5.1(E) R12.1 R13.1 R21.1 R26.1
VCC-3.3v: R8.2 R9.2 R17.2 R24.2
VCC_12V: D6.2(A) D7.2(A) D8.2(K) D9.2(K) D11.2(A) D13.2(K) D14.2(A) D15.2(K) R14.4 R15.4 R23.4 R27.4
Rele1: U5.2 ; port S_Rele3
Rele2: U8.2 ; port S_Rele4
Rele3: U7.2 ; port S_Rele2
Rele4: U4.2 ; port S_Rele1
NetD6_1: D6.1(K) R10.2
NetD7_1: D7.1(K) R11.2
NetD8_1: D8.1(A) Q1.3(C) R10.1 R14.5 U4.5
NetD9_1: D9.1(A) Q2.3(C) R11.1 R15.5 U5.5
NetD11_1: D11.1(K) R19.2
NetD13_1: D13.1(A) Q4.3(C) R19.1 R23.5 U7.5
NetD14_1: D14.1(K) R25.2
NetD15_1: D15.1(A) Q5.3(C) R25.1 R27.5 U8.5
NetQ1_2: Q1.2(B) R12.2 U4.4
NetQ2_2: Q2.2(B) R13.2 U5.4
NetQ4_2: Q4.2(B) R21.2 U7.4
NetQ5_2: Q5.2(B) R26.2 U8.4
NetR8_1: R8.1 U4.1
NetR9_1: R9.1 U5.1
NetR14_1: R14.1 U19.2
NetR14_2: R14.2 U19.1
NetR15_1: R15.1 U18.2
NetR15_2: R15.2 U18.1
NetR17_1: R17.1 U7.1
NetR23_1: R23.1 U21.2
NetR23_2: R23.2 U21.1
NetR24_1: R24.1 U8.1
NetR27_1: R27.1 U20.2
NetR27_2: R27.2 U20.1

Not connected (* = marked no-connect by the designer): R14 3; R15 3; R23 3; R27 3; U4 6*; U5 6*; U7 6*; U8 6*

### Notes on the sheet
- Relé Luz
- Relé Ventilador
- Relé Calefactor
- Relé Extra
- Nota: No uso el NC dado que no es necesario
- Sheet
- of
- (in symbol Component_1) NC; NA

### Library data of the parts
D6 D7 D11 D14 = CMP-1488-00002-1: as D2 on sheet Sch_Buzzer; ComponentLink2URL: http://katalog.we-online.de/pbs/datasheet/7448042001.pdfhttp://katalog.we-online.de/pbs/datasheet/7448042001.pdfhttp://katalog.we-online.de/pbs/datasheet/7448042001.pdfhttp://katalog.we-online.de/pbs/datasheet/151031SS06000.pdf; ComponentLink1URL: http://www.we-online.com; ComponentLink2Description: Datasheet; PackageReference: Type 3mm; Emitting color: Super Red; ComponentLink1Description: Manufacturer URL
D8 D9 D13 D15 = Diode 1N4148: High Conductance Fast Diode; Published: 8-Jun-2000; LatestRevisionDate: 17-Jul-2002; LatestRevisionNote: Re-released for DXP Platform.; DatasheetVersion: 1997; PackageReference: DO-35; Publisher: Altium Limited; PackageDescription: Diode, Axial; Body 3.8 x 1.9 mm (LxDia. max), Lead Dia. 0.53 mm (max); Code_JEDEC: DO-204-AH; ComponentLink1Description: Manufacturer Link; ComponentLink1URL: http://www.fairchildsemi.com/; ComponentLink2Description: Datasheet; ComponentLink2URL: http://www.fairchildsemi.com/ds/1N%2F1N4148.pdf
Q1 Q2 Q4 Q5 = CMP-1048-01479-1: Amplifier Transistor, NPN Silicon, 3-Pin TO-92, Pb-Free, Tape and Reel; Manufacturer: On Semiconductor; fT Min (MHz): 100; IC Continuous (A): 0.6; ComponentLink3Description: Package Specification; PackageDescription: 3-Pin Transistor Outline, Body 4.825 x 3.685 mm, Pitch 1.27 mm; ComponentLink1Description: Manufacturer URL; Mounting Technology: Through Hole; Packing: Tape and Reel; PartNumber: 2N5551RL1G; ComponentLink3URL: http://www.onsemi.com/pub_link/Collateral/MAC97-D.PDF; PackageReference: TO-92-3-29-11_AM_BL; ComponentLink2Description: Datasheet; PackageVersion: Rev. AM; DatasheetVersion: Rev. 5; ComponentLink1URL: http://www.onsemi.com/; RoHS: TRUE; ComponentLink2URL: http://www.onsemi.com/pub_link/Collateral/2N5550-D.PDF; Polarity: NPN
R8-R13 R17 R19 R21 R24-R26 = Res1: Resistor; Published: 8-Jun-2000; LatestRevisionDate: 17-Jul-2002; LatestRevisionNote: Re-released for DXP Platform.; PackageReference: AXIAL-0.3; Publisher: Altium Limited; PackageDescription: Axial Device, Thru-Hole; 2 Leads; 0.3 in Pin Spacing
R14 R15 R23 R27 = Component_1
U4 U5 U7 U8 = Opto-4N25: Optoacoplador

## Sheet Sch_SD.SchDoc: Control de Domótica
size A4; Author: Francisco González González - Eugenia Ipar; CompanyName: Conexión a Tarjeta SD; DocumentNumber: 11; SheetNumber: 11; SheetTotal: 12; Materia: Técnicas Digitales II; Placa: Conexión a SD Card; Year: 2015; Prof1: Prof: Alarcón, Juan; Prof2: Ayud: Crivelli, Marcelo; Prof3: Ayud: Montalti, Pablo; PageSetup: Record=PageOptions|CenterHorizontal=True|CenterVertical=True|PrintScale=1.00|XCorrection=1.00|YCorrection=1.00|PrintKind=0|BorderSize=5000000|LeftOffset=0|BottomOffset=0|Orientation=2|PaperLength=1000|PaperWidth=1000|Scale=100|PaperSource=7|PrintQuality=-3|MediaType=1|DitherType=10|PrintScaleMode=1|PaperKind=A4|PaperIndex=9
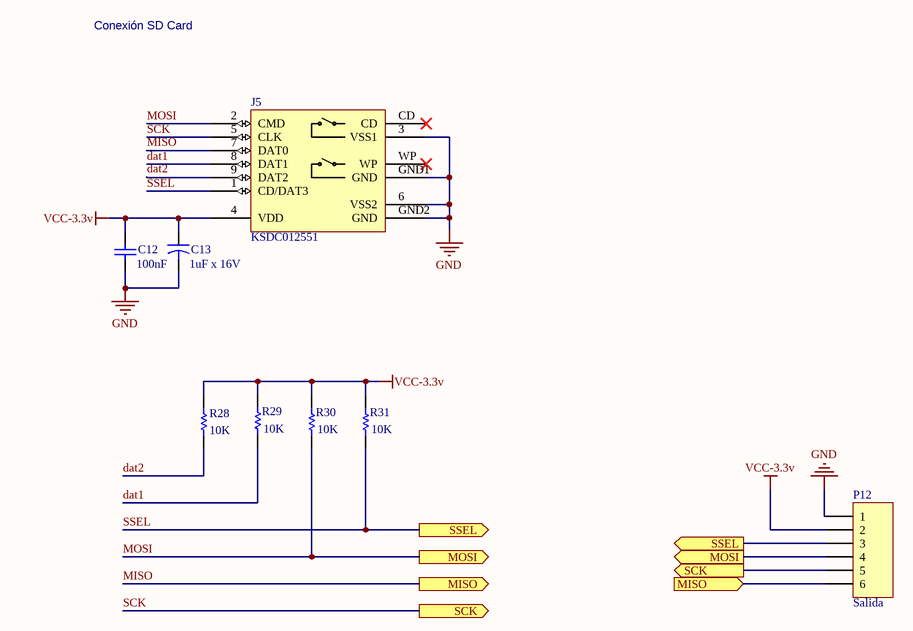
[diagram p6: Sch_SD.SchDoc]

### Parts
C12  value 100nF  [RAD-0.3]  (hidden comment: Cap)
C13  value 1uF x 16V  [CAPR5-4X5]  (hidden comment: Cap2)
J5  KSDC012551  [KONV-KSDC012551_V]
P12  Salida  [HDR1X6]
R28  value 10K  [AXIAL-0.3]  (hidden comment: Res1)
R29  value 10K  [AXIAL-0.3]  (hidden comment: Res1)
R30  value 10K  [AXIAL-0.3]  (hidden comment: Res1)
R31  value 10K  [AXIAL-0.3]  (hidden comment: Res1)

### Ports
MISO (in), MISO (out), MOSI (out), SCK (out), SSEL (out)

### Nets
GND: C12.1 C13.2 J5.3(VSS1) J5.6(VSS2) J5.GND1(GND) J5.GND2(GND) P12.1
VCC-3.3v: C12.2 C13.1 J5.4(VDD) P12.2 R28.2 R29.2 R30.2 R31.2
dat1: J5.8(DAT1) R29.1
dat2: J5.9(DAT2) R28.1
MISO: J5.7(DAT0) P12.6 ; port MISO
MOSI: J5.2(CMD) P12.4 R30.1 ; port MOSI
SCK: J5.5(CLK) P12.5 ; port SCK
SSEL: J5.1(CD/DAT3) P12.3 R31.1 ; port SSEL

Not connected (* = marked no-connect by the designer): J5 CD* WP*

### Notes on the sheet
- Conexión SD Card
- Sheet
- of

### Library data of the parts
C12 = Cap: Capacitor; Published: 8-Jun-2000; LatestRevisionDate: 17-Jul-2002; LatestRevisionNote: Re-released for DXP Platform.; PackageReference: RAD-0.3; Publisher: Altium Limited; PackageDescription: Radial Cap, Thru-Hole; 2 Leads; 0.3 in Pin Spacing
C13 = Cap2: Capacitor; Published: 23-Sep-2002; PackageReference: CAPR5-4X5; Publisher: Altium Limited; PackageDescription: Capacitor; 2 Leads
J5 = CMP-0408-00001-2: Secure Digital Card Socket; Manufacturer: Konvee Electronic; ComponentLink1URL: http://www.konvee.com/; PackageReference: KSDC012551; ComponentLink1Description: Manufacturer URL; PackageDescription: SD Card Socket; PartNumber: KSDC012551
P12 = Header 6: Header, 6-Pin; LatestRevisionDate: 17-Jul-2002; LatestRevisionNote: Re-released for DXP Platform.; Publisher: Altium Limited
R28-R31 = Res1: Resistor; Published: 8-Jun-2000; LatestRevisionDate: 17-Jul-2002; LatestRevisionNote: Re-released for DXP Platform.; PackageReference: AXIAL-0.3; Publisher: Altium Limited; PackageDescription: Axial Device, Thru-Hole; 2 Leads; 0.3 in Pin Spacing

## Sheet Sch_Sensores.SchDoc: Control de Domótica
size A4; Author: Francisco González González - Eugenia Ipar; CompanyName: Control de Sensores; DocumentNumber: 5; SheetNumber: 5; SheetTotal: 12; Materia: Técnicas Digitales II; Year: 2015; Placa: Sensores; Prof1: Prof: Alarcón, Juan; Prof2: Ayud: Crivelli, Marcelo; Prof3: Ayud: Montalti, Pablo; PageSetup: Record=PageOptions|CenterHorizontal=True|CenterVertical=True|PrintScale=1.00|XCorrection=1.00|YCorrection=1.00|PrintKind=0|BorderSize=5000000|LeftOffset=0|BottomOffset=0|Orientation=2|PaperLength=1000|PaperWidth=1000|Scale=100|PaperSource=7|PrintQuality=-3|MediaType=1|DitherType=10|PrintScaleMode=1|PaperKind=A4|PaperIndex=9
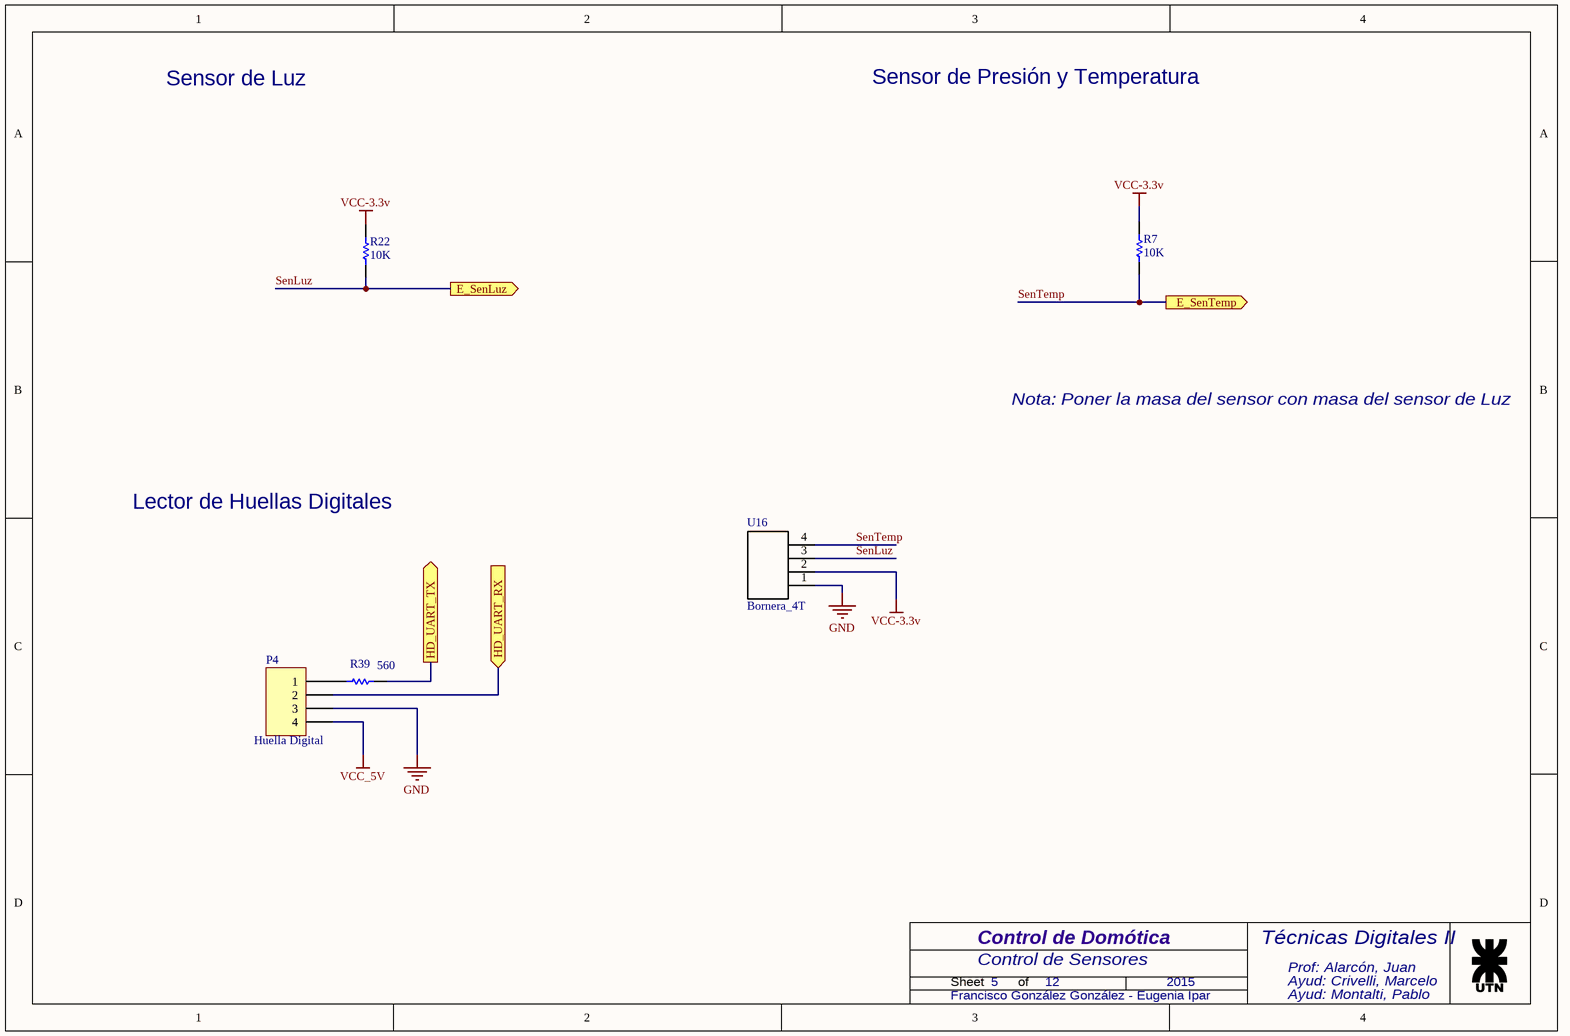
[diagram p7: Sch_Sensores.SchDoc]

### Parts
P4  Huella Digital  [HDR1X4]
R7  value 10K  [AXIAL-0.3]  (hidden comment: Res1)
R22  value 10K  [AXIAL-0.3]  (hidden comment: Res1)
R39  value 560  [AXIAL-0.3]  (hidden comment: Res1)
U16  Bornera_4T  [BORNERA_4]

### Ports
E_SenLuz (out), E_SenTemp (out), HD_UART_RX (in), HD_UART_TX (out)

### Nets
GND: P4.3 U16.1
VCC-3.3v: R7.2 R22.2 U16.2
VCC_5V: P4.4
RXD3: R39.1 ; port HD_UART_TX
SenLuz: R22.1 U16.3 ; port E_SenLuz
SenTemp: R7.1 U16.4 ; port E_SenTemp  [project net Sensor_Temp]
TXD3: P4.2 ; port HD_UART_RX
NetP4_1: P4.1 R39.2

### Notes on the sheet
- Sensor de Luz
- Sensor de Presión y Temperatura
- Nota: Poner la masa del sensor con masa del sensor de Luz
- Lector de Huellas Digitales
- Sheet
- of

### Library data of the parts
P4 = Header 4: Header, 4-Pin; LatestRevisionDate: 17-Jul-2002; LatestRevisionNote: Re-released for DXP Platform.; Publisher: Altium Limited
R7 R22 R39 = Res1: Resistor; Published: 8-Jun-2000; LatestRevisionDate: 17-Jul-2002; LatestRevisionNote: Re-released for DXP Platform.; PackageReference: AXIAL-0.3; Publisher: Altium Limited; PackageDescription: Axial Device, Thru-Hole; 2 Leads; 0.3 in Pin Spacing
U16 = Bornera_4T: Bornera de 4 Terminales Pitch 5mm

## Sheet Sch_USBSerie.SchDoc: Control de Domótica
size A4; Author: Francisco González González - Eugenia Ipar; CompanyName: Conexión USB y Puerto Serie; DocumentNumber: 10; SheetNumber: 10; SheetTotal: 12; Materia: Técnicas Digitales II; Placa: USB - USB a Puerto Serie; Year: 2015; Prof1: Prof: Alarcón, Juan; Prof2: Ayud: Crivelli, Marcelo; Prof3: Ayud: Montalti, Pablo; PageSetup: Record=PageOptions|CenterHorizontal=True|CenterVertical=True|PrintScale=1.00|XCorrection=1.00|YCorrection=1.00|PrintKind=0|BorderSize=5000000|LeftOffset=0|BottomOffset=0|Orientation=2|PaperLength=1000|PaperWidth=1000|Scale=100|PaperSource=7|PrintQuality=-3|MediaType=1|DitherType=10|PrintScaleMode=1|PaperKind=A4|PaperIndex=9
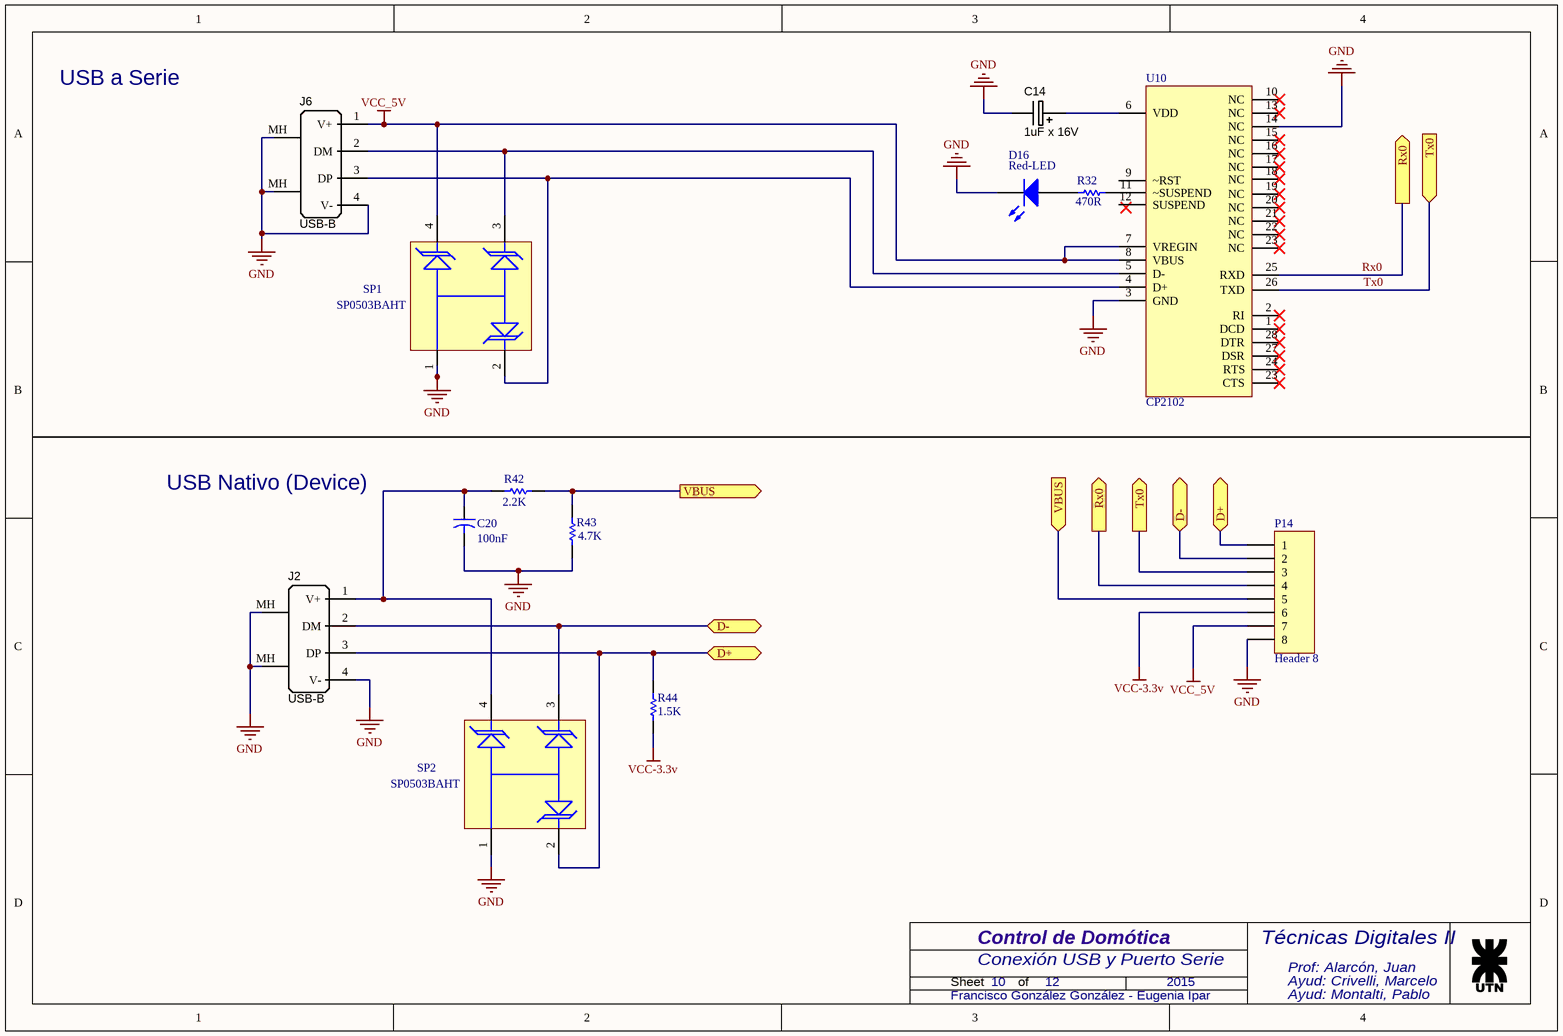
[diagram p8: Sch_USBSerie.SchDoc]

### Parts
C14  1uF x 16V  [CAPE3.5mm]
C20  value 100nF  [CAPR5-4X5]  (hidden comment: Cap2)
D16  Red-LED  [Type 3mm]
J2  USB-B  [USB_TypeB_Tyco]
J6  USB-B  [USB_TypeB_Tyco]
P14  Header 8  [HDR1X8]
R32  value 470R  [AXIAL-0.3]  (hidden comment: Res1)
R42  value 2.2K  [AXIAL-0.3]  (hidden comment: Res1)
R43  value 4.7K  [AXIAL-0.3]  (hidden comment: Res1)
R44  value 1.5K  [AXIAL-0.3]  (hidden comment: Res1)
SP1  SP0503BAHT  [SOT190P237X120-4N]
SP2  SP0503BAHT  [SOT190P237X120-4N]
U10  CP2102  [CP2102]

### Ports
D+ (bidir), D- (bidir), Rx0 (out), Tx0 (in), Tx0 (out), VBUS (in), VBUS (out)

### Nets
GND: C14.2 C20.2 D16.1(K) J2.4(V-) J2.MH(Shell) J6.4(V-) J6.MH(Shell) P14.8 R43.1 SP1.1 SP2.1 U10.3(GND) U10.14(NC)
VCC-3.3v: P14.6 R44.1
VCC_5V: J6.1(V+) P14.7 SP1.4 U10.7(VREGIN) U10.8(VBUS)
Rx0: P14.4 U10.25(RXD) ; port Rx0
Tx0: P14.3 U10.26(TXD) ; port Tx0  [project net RXD2]
USB_D+: J2.3(DP) P14.1 R44.2 SP2.2 ; port D+
USB_D-: J2.2(DM) P14.2 SP2.3 ; port D-
VBUS: P14.5 R42.2 R43.2 ; port VBUS
NetC14_1: C14.1 U10.6(VDD)
NetC20_1: C20.1 J2.1(V+) R42.1 SP2.4
NetD16_2: D16.2(A) R32.1
NetJ6_2: J6.2(DM) SP1.3 U10.5(D-)
NetJ6_3: J6.3(DP) SP1.2 U10.4(D+)
NetR32_2: R32.2 U10.11(~SUSPEND)

Not connected (* = marked no-connect by the designer): U10 1(DCD)* 2(RI)* 9(~RST) 10(NC)* 12(SUSPEND) 13(NC)* 15(NC)* 16(NC)* 17(NC)* 18(NC)* 19(NC)* 20(NC)* 21(NC)* 22(NC)* 23(NC)* 24(RTS)* 27(DSR)* 28(DTR)*

### Notes on the sheet
- USB a Serie
- USB Nativo (Device)
- Sheet
- of

### Library data of the parts
C14 = CAPE_220u_16V_THD: Capacitor THT Alum Elec 220uF 20% 16V; Manufacturer 1: Nichicon; Manufacturer Part Number 1: UPW1C221MPD; Ratings: 16V; 80°C; Material: Al; SCDType: undef; Manufacturer 2: Zhuhai Gree Xinyuan Electric; Manufacturer Part Number 2: CD11C-220-16V; Package / Case: radial 8.0D x 7.0H x 3.5mm pitch; Tolerance: ±20%; Supplier 1: Digi-Key; Supplier Part Number 1: 493-1783-ND; Value: 1uF x 16V
C20 = Cap2: Capacitor; Published: 23-Sep-2002; PackageReference: CAPR5-4X5; Publisher: Altium Limited; PackageDescription: Capacitor; 2 Leads
D16 = CMP-1488-00002-1: as D2 on sheet Sch_Buzzer; ComponentLink2URL: http://katalog.we-online.de/pbs/datasheet/7448042001.pdfhttp://katalog.we-online.de/pbs/datasheet/7448042001.pdfhttp://katalog.we-online.de/pbs/datasheet/7448042001.pdfhttp://katalog.we-online.de/pbs/datasheet/151031SS06000.pdf; ComponentLink1URL: http://www.we-online.com; ComponentLink2Description: Datasheet; PackageReference: Type 3mm; Emitting color: Super Red; ComponentLink1Description: Manufacturer URL
J2 J6 = USB_TypeB: Connector THT Type B USB connector; Manufacturer Part Number 1: 292304-1; Manufacturer 1: TE Connectivity; Specifications: USB 2.0; SCDType: undef; Package / Case: R/A Type B; Supplier 1: Digi-Key; Connector Type: USB - B; Supplier Part Number 1: A31725-ND
P14 = Header 8: Header, 8-Pin; LatestRevisionDate: 17-Jul-2002; LatestRevisionNote: Re-released for DXP Platform.; Publisher: Altium Limited
R32 R42-R44 = Res1: Resistor; Published: 8-Jun-2000; LatestRevisionDate: 17-Jul-2002; LatestRevisionNote: Re-released for DXP Platform.; PackageReference: AXIAL-0.3; Publisher: Altium Limited; PackageDescription: Axial Device, Thru-Hole; 2 Leads; 0.3 in Pin Spacing
SP1 SP2 = Component_1: Diode Array 30pF 30kV
U10 = Component_1

## Sheet Sch_Motor.SchDoc: Control de Domótica
size A4; Author: Francisco González González - Eugenia Ipar; CompanyName: Control de los Motores; DocumentNumber: 8; SheetNumber: 8; SheetTotal: 12; Materia: Técnicas Digitales II; Placa: Conexión a Motores; Year: 2015; Prof1: Prof: Alarcón, Juan; Prof2: Ayud: Crivelli, Marcelo; Prof3: Ayud: Montalti, Pablo; PageSetup: Record=PageOptions|CenterHorizontal=True|CenterVertical=True|PrintScale=1.00|XCorrection=1.00|YCorrection=1.00|PrintKind=0|BorderSize=5000000|LeftOffset=0|BottomOffset=0|Orientation=2|PaperLength=1000|PaperWidth=1000|Scale=100|PaperSource=7|PrintQuality=-3|MediaType=1|DitherType=10|PrintScaleMode=1|PaperKind=A4|PaperIndex=9
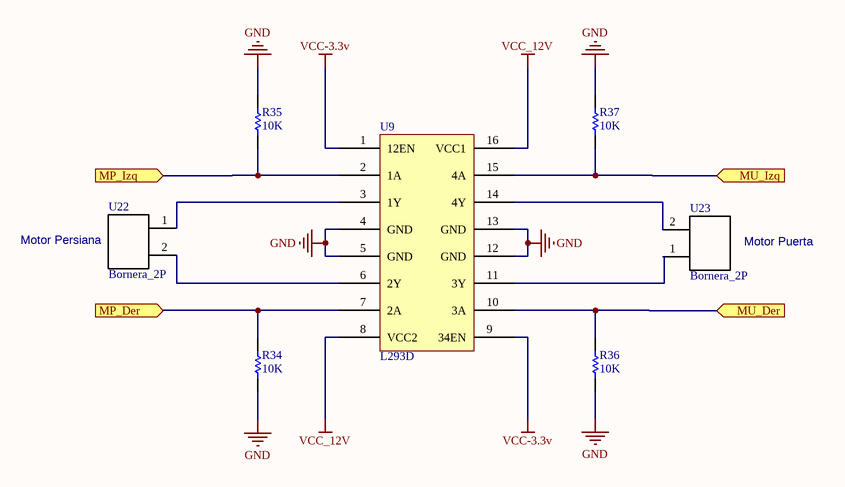
[diagram p9: Sch_Motor.SchDoc]

### Parts
R34  value 10K  [AXIAL-0.3]  (hidden comment: Res1)
R35  value 10K  [AXIAL-0.3]  (hidden comment: Res1)
R36  value 10K  [AXIAL-0.3]  (hidden comment: Res1)
R37  value 10K  [AXIAL-0.3]  (hidden comment: Res1)
U9  L293D  [DIP16]
U22  Bornera_2P  [Bornera]
U23  Bornera_2P  [Bornera]

### Ports
MP_Der (in), MP_Izq (in), MU_Der (in), MU_Izq (in)

### Nets
GND: R34.1 R35.2 R36.1 R37.2 U9.4(GND) U9.5(GND) U9.12(GND) U9.13(GND)
VCC-3.3v: U9.1(12EN) U9.9(34EN)
VCC_12V: U9.8(VCC2) U9.16(VCC1)
Persi_Der: R34.2 U9.7(2A) ; port MP_Der
Persi_Izq: R35.1 U9.2(1A) ; port MP_Izq
Puerta_Der: R36.2 U9.10(3A) ; port MU_Der
Puerta_Izq: R37.1 U9.15(4A) ; port MU_Izq
NetU9_3: U9.3(1Y) U22.1
NetU9_6: U9.6(2Y) U22.2
NetU9_11: U9.11(3Y) U23.1
NetU9_14: U9.14(4Y) U23.2

### Notes on the sheet
- (near U22) Motor Persiana
- Motor Puerta
- Sheet
- of

### Library data of the parts
R34-R37 = Res1: Resistor; Published: 8-Jun-2000; LatestRevisionDate: 17-Jul-2002; LatestRevisionNote: Re-released for DXP Platform.; PackageReference: AXIAL-0.3; Publisher: Altium Limited; PackageDescription: Axial Device, Thru-Hole; 2 Leads; 0.3 in Pin Spacing
U9 = L293D: Texas Quadruple Half-H Drivers

## Sheet Sch_LCD.SchDoc: Control de Domótica
size A4; Author: González González, Francisco - Ipar, Eugenia; CompanyName: Conexión Display LCD; DocumentNumber: 9; SheetNumber: 9; SheetTotal: 12; Prof1: Prof: Alarcón, Juan; Prof2: Ayud: Crivelli, Marcelo; Prof3: Ayud: Montalti, Pablo; Materia: Técnicas Digitales II; Proyecto: Control de Domótica; Year: 2015; ProjectName: Control de Domótica
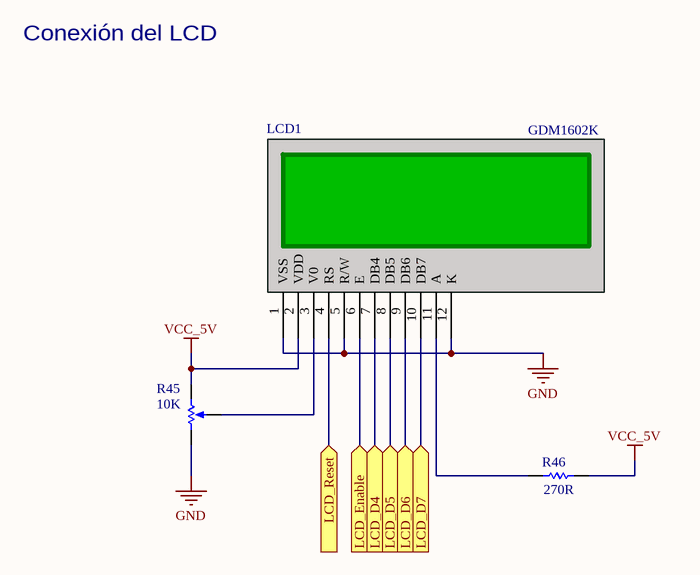
[diagram p10: Sch_LCD.SchDoc]

### Parts
LCD1  GDM1602K  [LCD]
R45  value 10K  [VR5]  (hidden comment: RPot)
R46  value 270R  [AXIAL-0.3]  (hidden comment: Res1)

### Ports
LCD_D4 (in), LCD_D5 (in), LCD_D6 (in), LCD_D7 (in), LCD_Enable (in), LCD_Reset (in)

### Nets
GND: LCD1.1(VSS) LCD1.5(R/W) LCD1.12(K) R45.1(TOP)
VCC_5V: LCD1.2(VDD) R45.2(BOT) R46.2
LCD_DB4: LCD1.7(DB4) ; port LCD_D4
LCD_DB5: LCD1.8(DB5) ; port LCD_D5
LCD_DB6: LCD1.9(DB6) ; port LCD_D6
LCD_DB7: LCD1.10(DB7) ; port LCD_D7
LCD_ENABLE: LCD1.6(E) ; port LCD_Enable
LCD_RST: LCD1.4(RS) ; port LCD_Reset
NetLCD1_3: LCD1.3(V0) R45.3(TAP)
NetLCD1_11: LCD1.11(A) R46.1

### Notes on the sheet
- Conexión del LCD
- Sheet
- of

### Library data of the parts
LCD1 = LCD: LCD GDM1602K Rev2.2
R45 = RPot: Potentiometer; Sim Note: Enter the Resistance value and the set point into parameter fields.; Set Position: 0.5; Published: 8-Jun-2000; LatestRevisionDate: 17-Jul-2002; LatestRevisionNote: Re-released for DXP Platform.; PackageReference: VR5; Publisher: Altium Limited; PackageDescription: Variable Resistor, Thru-Hole; 3 Leads
R46 = Res1: Resistor; Published: 8-Jun-2000; LatestRevisionDate: 17-Jul-2002; LatestRevisionNote: Re-released for DXP Platform.; PackageReference: AXIAL-0.3; Publisher: Altium Limited; PackageDescription: Axial Device, Thru-Hole; 2 Leads; 0.3 in Pin Spacing

## Sheet Sch_Fuente.SchDoc: Control de Domótica
size A4; Author: Francisco González González - Eugenia Ipar; CompanyName: Fuente de Alimentación; DocumentNumber: 3; SheetNumber: 3; SheetTotal: 12; Materia: Técnicas Digitales II; Placa: Fuente de Alimentación; Year: 2015; Prof1: Prof: Alarcón, Juan; Prof2: Ayud: Crivelli, Marcelo; Prof3: Ayud: Montalti, Pablo; PageSetup: Record=PageOptions|CenterHorizontal=True|CenterVertical=True|PrintScale=1.00|XCorrection=1.00|YCorrection=1.00|PrintKind=0|BorderSize=5000000|LeftOffset=0|BottomOffset=0|Orientation=2|PaperLength=1000|PaperWidth=1000|Scale=100|PaperSource=7|PrintQuality=-3|MediaType=1|DitherType=10|PrintScaleMode=1|PaperKind=A4|PaperIndex=9
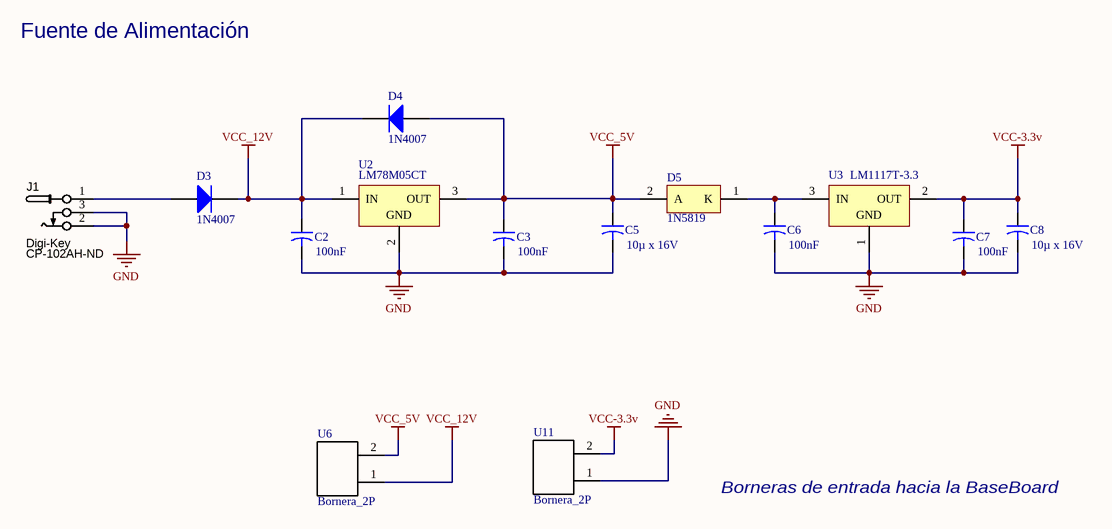
[diagram p11: Sch_Fuente.SchDoc]

### Parts
C2  value 100nF  [CAPR5-4X5]  (hidden comment: Cap2)
C3  value 100nF  [CAPR5-4X5]  (hidden comment: Cap2)
C5  value 10µ x 16V  [CAPR5-4X5]  (hidden comment: Cap2)
C6  value 100nF  [CAPR5-4X5]  (hidden comment: Cap2)
C7  value 100nF  [CAPR5-4X5]  (hidden comment: Cap2)
C8  value 10µ x 16V  [CAPR5-4X5]  (hidden comment: Cap2)
D3  1N4007  [DO-41]
D4  1N4007  [DO-41]
D5  1N5819  [ONSC-AXIAL_LEAD-2-59-10_P]
J1  Supplier 1: Digi-Key  Supplier Part Number 1: CP-102AH-ND  [CONN_PWR_JACK_2.1x5.5mm]  (hidden comment: CONN_PWR_JACK_2.1x5.5mm)
U2  LM78M05CT  [T03B]
U3  LM1117T-3.3  [T03B]
U6  Bornera_2P  [Bornera]
U11  Bornera_2P  [Bornera]

### Nets
GND: C2.2 C3.2 C5.2 C6.2 C7.2 C8.2 J1.2 J1.3 U2.2(GND) U3.1(GND) U11.1
VCC-3.3v: C7.1 C8.1 U3.2(OUT) U11.2
VCC_5V: C3.1 C5.1 D4.1(A) D5.2(A) U2.3(OUT) U6.2
VCC_12V: C2.1 D3.2(K) D4.2(K) U2.1(IN) U6.1
NetC6_1: C6.1 D5.1(K) U3.3(IN)
NetD3_1: D3.1(A) J1.1

### Notes on the sheet
- Fuente de Alimentación
- Borneras de entrada hacia la BaseBoard
- Sheet
- of

### Library data of the parts
C2 C3 C5-C8 = Cap2: Capacitor; Published: 23-Sep-2002; PackageReference: CAPR5-4X5; Publisher: Altium Limited; PackageDescription: Capacitor; 2 Leads
D3 D4 = Diode 1N4007: 1 Amp General Purpose Rectifier; Published: 8-Jun-2000; LatestRevisionDate: 17-Jul-2002; LatestRevisionNote: Re-released for DXP Platform.; DatasheetVersion: 1998; PackageVersion: Aug-1999; PackageReference: DO-41; Publisher: Altium Limited; PackageDescription: Diode, Axial; Body 5.2 x 2.7 mm (LxDia. max), Lead Dia. 0.86 mm (max); Code_JEDEC: DO-204-AL; ComponentLink1Description: Manufacturer Link; ComponentLink1URL: http://www.fairchildsemi.com/; ComponentLink2Description: Datasheet; ComponentLink2URL: http://www.fairchildsemi.com/ds/1N%2F1N4001.pdf
D5 = CMP-1055-00042-1: Rectifier, 2-Pin Axial_Lead, Pb-Free, Bulk Bag; Manufacturer: On Semiconductor; IFSM Max (A): 25; Configuration: Single; Note1: 0; PackageDescription: 2-Pin, Axial Lead, Diameter 2.35 mm; Mounting Technology: Through Hole; Packing: Bulk Bag; RoHS: TRUE; DatasheetVersion: Rev. 10; ComponentLink3Description: Package Specification; ComponentLink1URL: http://www.onsemi.com/; ComponentLink2Description: Datasheet; PackageReference: AXIAL_LEAD-2-59-10; ComponentLink3URL: http://www.onsemi.cn/pub_link/Collateral/59-10.PDF; PackageVersion: Rev. U, 02/2005; PartNumber: 1N5819; ComponentLink1Description: Manufacturer URL; ComponentLink2URL: http://www.onsemi.cn/pub_link/Collateral/1N5817-D.PDF
J1 = CONN_PWR_JACK_2.1x5.5mm: Power Connector, THT, 2.1mm ID, 5.5mm OD; Manufacturer 1: CUI Inc; Manufacturer Part Number 1: PJ-102AH; SCDType: undef; Category: Connectors; Mounting Type: Through Hole; Package / Case: PCB mount; Value: 2.1mm ID, 5.5mm OD
U2 = CMP-0062-02484-2: 3-Terminal Positive Voltage Regulators, 3-pin TO-220; Manufacturer: National Semiconductor; PowerWise: N; PackageTopMarking: NSUZXYTTE#*LM341T-5.0*LM78M05CT; CompType: LDO IC; ComponentLink3Description: T03B Package Page; ComponentLink1URL: http://www.national.com/ds/LM/LM78M05.pdf; PinCount: 3; PackageVersion: revL, Jan-1992; PackageReference: T03B; ComponentLink1Description: LM78M05 Datasheet; ComponentLink2Description: LM78M05 Web Page; ComponentLink3URL: http://www.national.com/packaging/folders/t03b.html; RevisionNote: Component URLs added; PackageDescription: TO-220, Molded, 3 Lead, Straight; RoHS: N; DatasheetVersion: Aug-2005; ComponentLink2URL: http://www.national.com/pf/LM/LM78M05.html
U3 = CMP-0062-02490-2: 800mA Low-Dropout Linear Regulator, 3-pin TO-220; Manufacturer: National Semiconductor; PowerWise: N; CompType: LDO IC; PackageTopMarking: NSUZXYTTE#*LM1117T*3.3; ComponentLink1Description: LM1117 Datasheet; RoHS: N; PinCount: 3; DatasheetVersion: Apr-2006; PackageDescription: TO-220, Molded, 3 Lead, Straight; ComponentLink2URL: http://www.national.com/pf/LM/LM1117.html; ComponentLink2Description: LM1117 Web Page; RevisionNote: Component URLs added; ComponentLink3Description: T03B Package Page; PackageReference: T03B; ComponentLink1URL: http://www.national.com/ds/LM/LM1117.pdf; PackageVersion: revL, Jan-1992; ComponentLink3URL: http://www.national.com/packaging/folders/t03b.html

## Nets that join several sheets
GND: Sch_Stick (7 pins), Sch_Ethernet (6 pins), Sch_Buzzer (10 pins), Sch_FindeCarrera (6 pins), Sch_Rele (8 pins), Sch_SD (7 pins), Sch_Sensores (P4.3 U16.1), Sch_USBSerie (13 pins), Sch_Motor (8 pins), Sch_LCD (LCD1.1 LCD1.5 LCD1.12 R45.1), Sch_Fuente (11 pins)
VCC-3.3v: Sch_Stick (6 pins), Sch_Ethernet (7 pins), Sch_Buzzer (8 pins), Sch_FindeCarrera (R3.2 R16.2 R18.2 R20.2), Sch_Rele (R8.2 R9.2 R17.2 R24.2), Sch_SD (8 pins), Sch_Sensores (R7.2 R22.2 U16.2), Sch_USBSerie (P14.6 R44.1), Sch_Motor (U9.1 U9.9), Sch_Fuente (C7.1 C8.1 U3.2 U11.2)
VCC_5V: Sch_Stick (P3.3 U27.2), Sch_Buzzer (D2.2 D17.2 R33.2), Sch_Sensores (P4.4), Sch_USBSerie (5 pins), Sch_LCD (LCD1.2 R45.2 R46.2), Sch_Fuente (6 pins)
VCC_12V: Sch_Stick (U26.1), Sch_Rele (12 pins), Sch_Motor (U9.8 U9.16), Sch_Fuente (5 pins)
Boton_Log: Sch_Stick (U1.11), Sch_Buzzer (C100.1 D120.1 R60.1 S30.2)
Botón_Enroll: Sch_Stick (U1.13), Sch_Buzzer (C17.1 D1.1 R38.1 S1.2)
Botón_Reset: Sch_Stick (U1.4), Sch_Buzzer (C10.1 D12.1 R6.1 S3.2)
Botón_Salida: Sch_Stick (U1.12), Sch_Buzzer (C1.1 D10.1 R5.1 S2.2)
ETH_RXN: Sch_Stick (P2.2 U1.32), Sch_Ethernet (CN1.6 P1.2)
ETH_RXP: Sch_Stick (P2.3 U1.33), Sch_Ethernet (CN1.3 P1.3)
ETH_TXN: Sch_Stick (P2.4 U1.34), Sch_Ethernet (CN1.1 P1.5)
ETH_TXP: Sch_Stick (P2.5 U1.35), Sch_Ethernet (CN1.2 P1.4)
FdC1: Sch_Stick (U1.49), Sch_FindeCarrera (C9.1 R3.1 U13.3)
FdC2: Sch_Stick (U1.48), Sch_FindeCarrera (C16.1 R20.1 U13.2)
FdC3: Sch_Stick (U1.47), Sch_FindeCarrera (C11.1 R16.1 U14.2)
FdC4: Sch_Stick (U1.46), Sch_FindeCarrera (C15.1 R18.1 U14.3)
LCD_DB4: Sch_Stick (U1.23), Sch_LCD (LCD1.7)
LCD_DB5: Sch_Stick (U1.24), Sch_LCD (LCD1.8)
LCD_DB6: Sch_Stick (U1.25), Sch_LCD (LCD1.9)
LCD_DB7: Sch_Stick (U1.26), Sch_LCD (LCD1.10)
LCD_ENABLE: Sch_Stick (U1.22), Sch_LCD (LCD1.6)
LCD_RST: Sch_Stick (U1.21), Sch_LCD (LCD1.4)
LED_Rojo: Sch_Stick (U1.14), Sch_Buzzer (LED2.2)
LED_Verde: Sch_Stick (U1.15), Sch_Buzzer (LED1.2)
MISO: Sch_Stick (P5.3 U1.6), Sch_SD (J5.7 P12.6)
MOSI: Sch_Stick (P5.4 U1.5), Sch_SD (J5.2 P12.4 R30.1)
OBuzzer: Sch_Stick (U1.16), Sch_Buzzer (Buz1.2 D17.1 R2.1)
Persi_Der: Sch_Stick (U1.51), Sch_Motor (R34.2 U9.7)
Persi_Izq: Sch_Stick (U1.50), Sch_Motor (R35.1 U9.2)
Puerta_Der: Sch_Stick (U1.73), Sch_Motor (R36.2 U9.10)
Puerta_Izq: Sch_Stick (U1.52), Sch_Motor (R37.1 U9.15)
Rele1: Sch_Stick (U1.42), Sch_Rele (U5.2)
Rele2: Sch_Stick (U1.43), Sch_Rele (U8.2)
Rele3: Sch_Stick (U1.44), Sch_Rele (U7.2)
Rele4: Sch_Stick (U1.45), Sch_Rele (U4.2)
Rx0: Sch_Stick (P3.6 U1.40), Sch_USBSerie (P14.4 U10.25)
RXD2: Sch_Stick (P3.7 U1.41), Sch_USBSerie (P14.3 U10.26)
RXD3: Sch_Stick (U1.10), Sch_Sensores (R39.1)
SCK: Sch_Stick (P5.2 U1.7), Sch_SD (J5.5 P12.5)
SenLuz: Sch_Stick (U1.17), Sch_Sensores (R22.1 U16.3)
Sensor_Temp: Sch_Stick (U1.18), Sch_Sensores (R7.1 U16.4)
SSEL: Sch_Stick (P5.1 U1.8), Sch_SD (J5.1 P12.3 R31.1)
TXD3: Sch_Stick (U1.9), Sch_Sensores (P4.2)
USB_D+: Sch_Stick (P3.5 U1.37), Sch_USBSerie (J2.3 P14.1 R44.2 SP2.2)
USB_D-: Sch_Stick (P3.4 U1.36), Sch_USBSerie (J2.2 P14.2 SP2.3)
VBUS: Sch_Stick (P3.8 U1.19), Sch_USBSerie (P14.5 R42.2 R43.2)